# EAGLE design harp behavior (EAGLE 6.5.0)

## Sheet 1 of 4
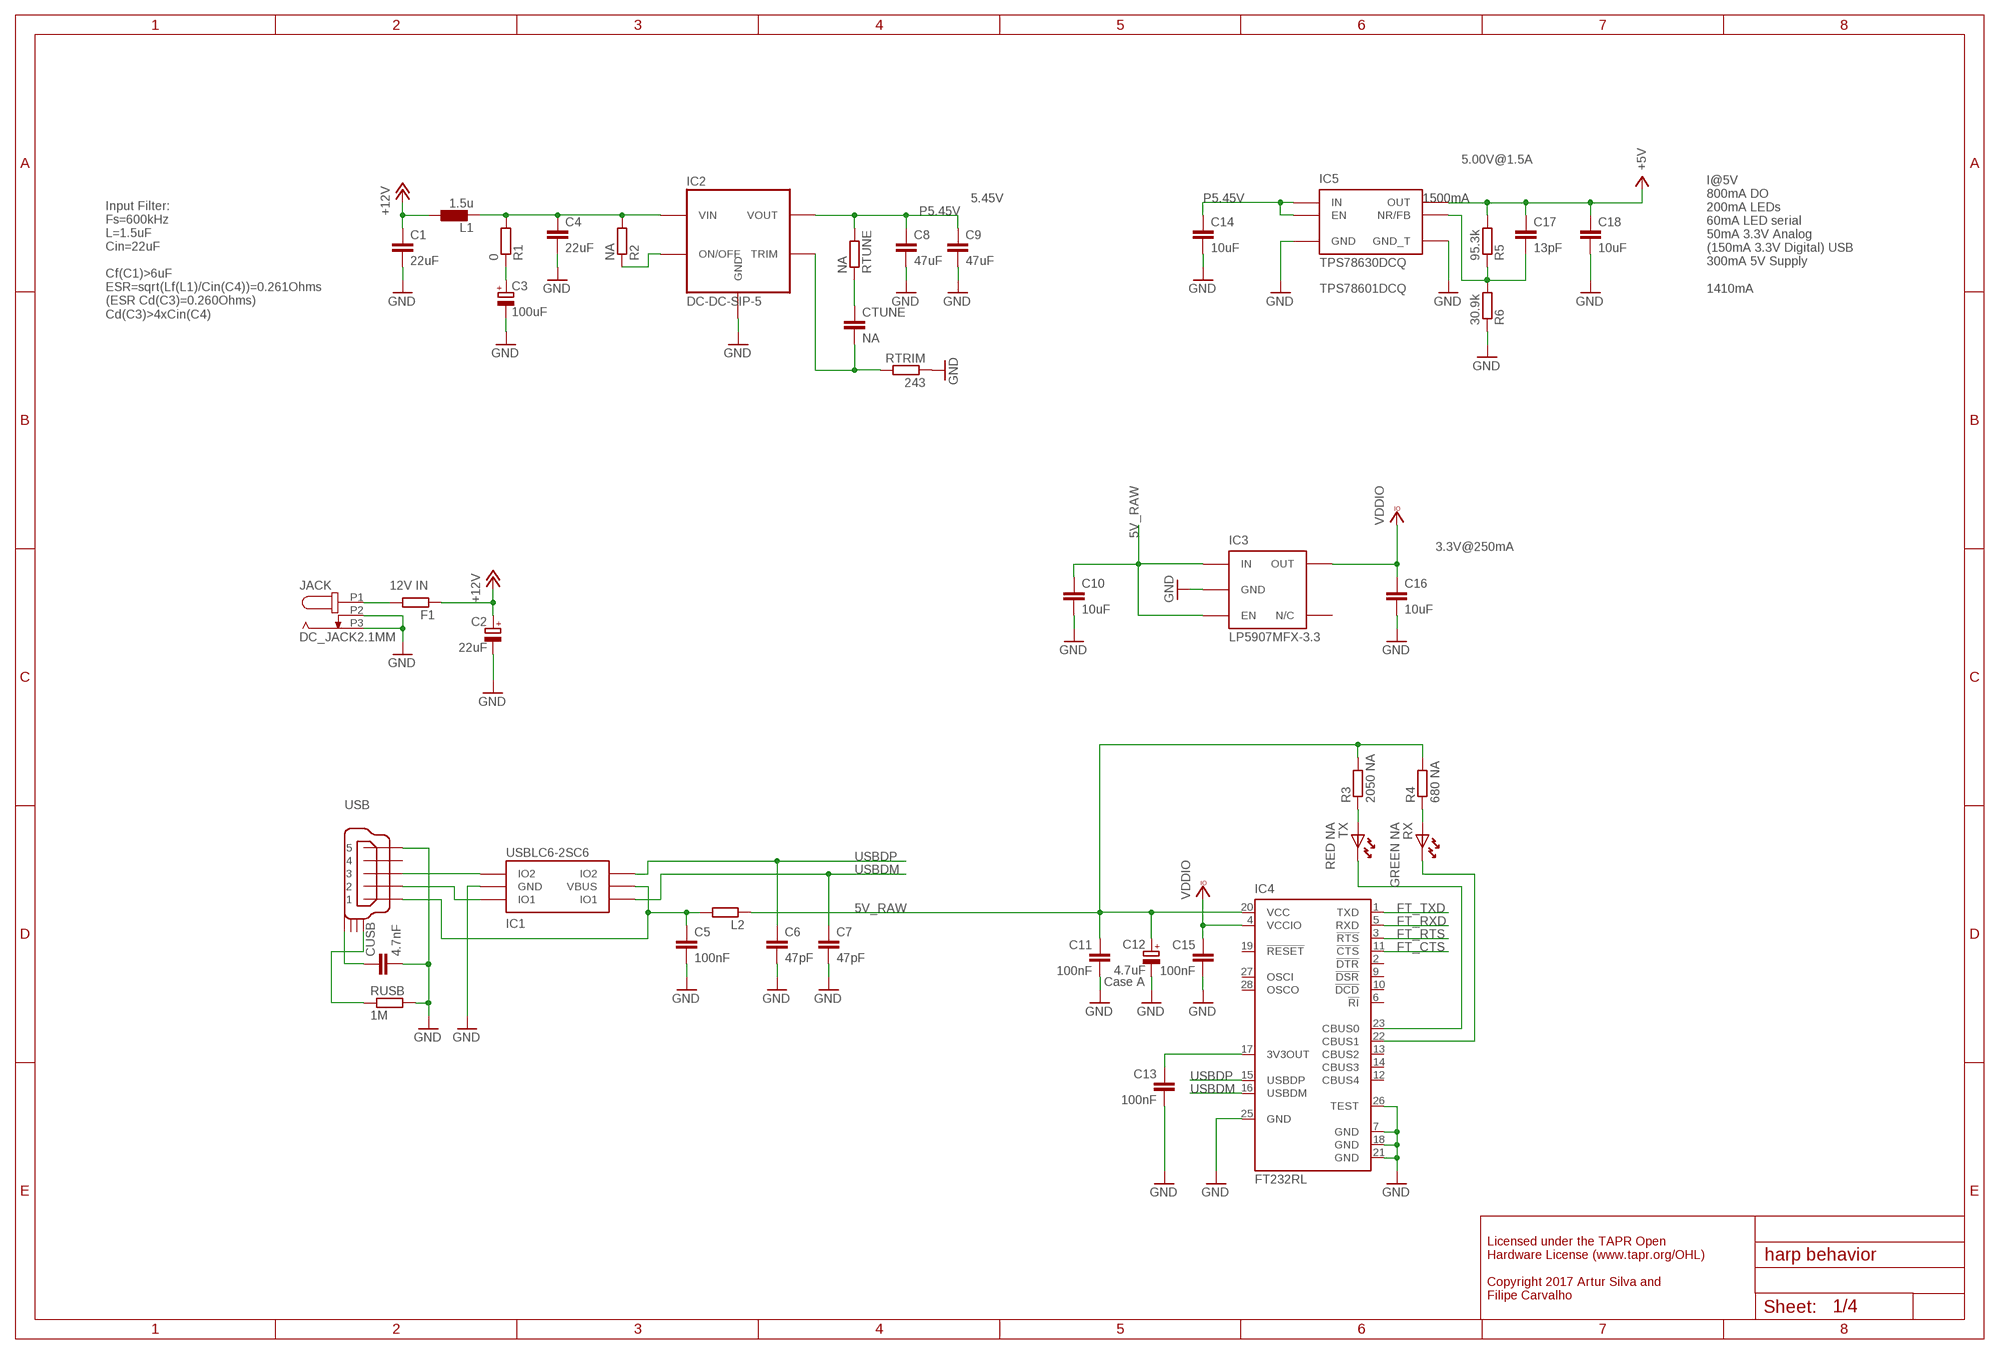
[diagram p0: schematic, sheet 1]

### Parts
C1  22uF  C-EUC1210  [C1210]
C2  22uF  CAP_100UFHAND  [CAP_100UF_HAND]
C3  100uF  CPOL-EUE  [PANASONIC_E]
C4  22uF  C-EUC1210  [C1210]
C5  100nF  C-EUC0402  [C0402]
C6  47pF  C-EUC0402  [C0402]
C7  47pF  C-EUC0402  [C0402]
C8  47uF  C-EUC1210  [C1210]
C9  47uF  C-EUC1210  [C1210]
C10  10uF  C-EUC0603  [C0603]
C11  100nF  C-EUC0402  [C0402]
C12  4.7uF  CPOL-EUA/3216-18W  [A/3216-18W]
C13  100nF  C-EUC0402  [C0402]
C14  10uF  C-EUC0603  [C0603]
C15  100nF  C-EUC0402  [C0402]
C16  10uF  C-EUC0603  [C0603]
C17  13pF  C-EUC0402  [C0402]
C18  10uF  C-EUC0603  [C0603]
CTUNE  NA  C-EUC0402  [C0402]
CUSB  4.7nF  C-EUC0402  [C0402]
F1  1A FB  R-EU_R0603  [R0603]
IC1  USBLC6-2SC6  USBLC6-2  [SOT23-6L]
IC2  DC-DC-SIP-5  [SIP-5]
IC3  LP5907MFX-3.3  TLV700XX  [TSOT23-5]
IC4  FT232RL  [SSOP28]
IC5  TPS78630DCQ  TPS795XX  [SOT223-6]
JACK  DC_JACK2.1MM  [DC_POWER_INPUT_2.1MM]
L1  1.5u  INDLPS4012  [IND_LPS4012]
L2  ???  R-EU_R0805  [R0805]
R1  0  R-EU_R0402  [R0402]
R2  NA  R-EU_R0402  [R0402]
R3  2050 NA  R-EU_R0402  [R0402]
R4  680 NA  R-EU_R0402  [R0402]
R5  95.3k  R-EU_R0402  [R0402]
R6  30.9k  R-EU_R0402  [R0402]
RTRIM  243  R-EU_R0402  [R0402]
RTUNE  NA  R-EU_R0402  [R0402]
RUSB  1M  R-EU_R0402  [R0402]
RX  GREEN NA  LEDHAND  [LED_HAND]
TX  RED NA  LEDHAND  [LED_HAND]
USB  USB_MINI_B  [240-0002-1]

### Nets
5V_RAW: C10.1 C11.1 C12.+ IC3.1(IN) IC3.3(EN) IC4.20(VCC) L2.1 R3.2 R4.2
+5V: C17.1 C18.1 IC5.P$4(OUT) R5.2 ; also sheet 2,3,4
+12V: C1.1 C2.+ F1.1 L1.1 ; also sheet 4
DCIN: C4.1 IC2.P2(VIN) L1.2 R1.2 R2.2
FT_CTS: IC4.11(!CTS) ; also sheet 2
FT_RTS: IC4.3(!RTS) ; also sheet 2
FT_RXD: IC4.5(RXD) ; also sheet 2
FT_TXD: IC4.1(TXD) ; also sheet 2
GND: C1.2 C2.- C3.- C4.2 C5.2 C6.2 C7.2 C8.2 C9.2 C10.2 C11.2 C12.- C13.2 C14.2 C15.2 C16.2 C18.2 CUSB.2 IC1.P$2(GND) IC2.P3(GND) IC3.2(GND) IC4.7(GND) IC4.18(GND) IC4.21(GND) IC4.25(GND) IC4.26(TEST) IC5.P$3(GND) IC5.P$6(GND_T) JACK.P2 JACK.P3 R6.1 RTRIM.1 RUSB.2 USB.P$5 ; also sheet 2,3,4
N$12: CTUNE.2 IC2.P5(TRIM) RTRIM.2
N$14: CTUNE.1 RTUNE.1
N$16: IC2.P1(ON/OFF) R2.1
N$18: F1.2 JACK.P1
N$20: C17.2 IC5.P$5(NR/FB) R5.1 R6.2
N$24: C3.+ R1.1
N$38: C13.1 IC4.17(3V3OUT)
N$39: C5.1 IC1.P$5(VBUS) L2.2 USB.P$1
N$40: IC1.P$1(IO1) USB.P$2
N$47: R4.1 RX.A
N$48: IC4.23(CBUS0) TX.K
N$49: IC4.22(CBUS1) RX.K
N$50: IC1.P$3(IO2) USB.P$3
N$59: CUSB.1 USB.SHIELD_4
N$61: RUSB.1 USB.SHIELD_1
N$62: R3.1 TX.A
P5.45V: C8.1 C9.1 C14.1 IC2.P4(VOUT) IC5.P$1(EN) IC5.P$2(IN) RTUNE.2
USBDM: C7.1 IC1.P$6(IO1) IC4.16(USBDM)
USBDP: C6.1 IC1.P$4(IO2) IC4.15(USBDP)
VCCIO: C15.1 C16.1 IC3.5(OUT) IC4.4(VCCIO) ; supply symbol labelled VDDIO ; also sheet 2,3,4
Unconnected: IC3.4(N/C) IC4.2(!DTR) IC4.6(!RI) IC4.9(!DSR) IC4.10(!DCD) IC4.12(CBUS4) IC4.13(CBUS2) IC4.14(CBUS3) IC4.19(!RESET) IC4.27(OSCI) IC4.28(OSCO) USB.P$4 USB.SHIELD_2 USB.SHIELD_3

### Notes on the sheet
- 5.00V@1.5A
- 5.45V | 1500mA
- TPS78601DCQ
- I@5V
  800mA DO
  200mA LEDs
  60mA LED serial
  50mA 3.3V Analog
  (150mA 3.3V Digital) USB
  300mA 5V Supply
  
  1410mA
- Input Filter:
  Fs=600kHz
  L=1.5uF
  Cin=22uF
  
  Cf(C1)>6uF
  ESR=sqrt(Lf(L1)/Cin(C4))=0.261Ohms
  (ESR Cd(C3)=0.260Ohms)
  Cd(C3)>4xCin(C4)
- 3.3V@250mA
- 12V IN
- Case A
- Licensed under the TAPR Open
  Hardware License (www.tapr.org/OHL)
  
  Copyright 2017 Artur Silva and 
  Filipe Carvalho

## Sheet 2 of 4
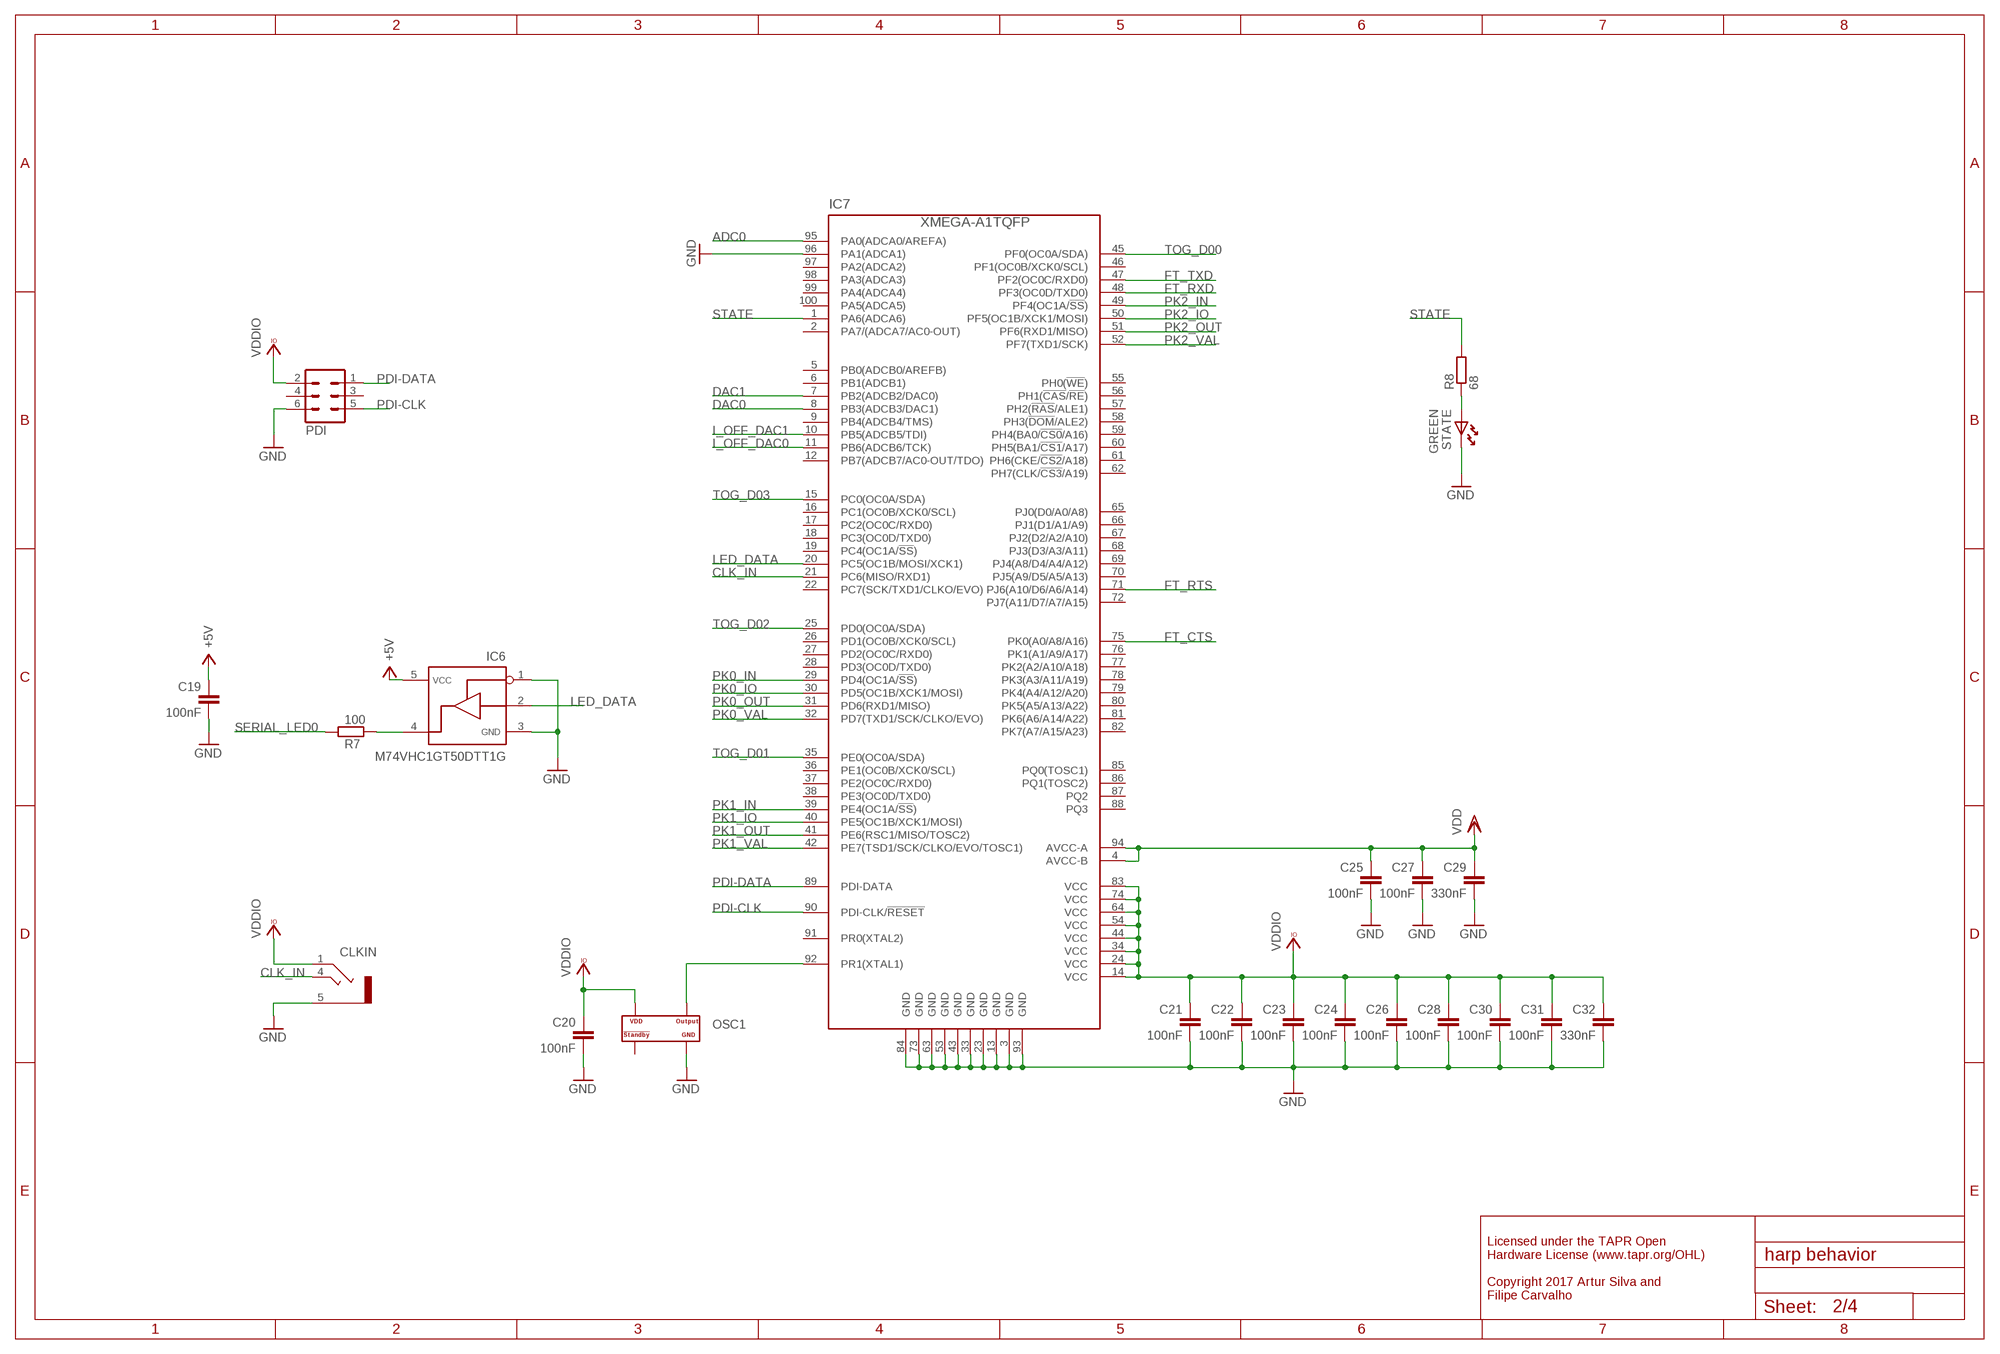
[diagram p1: schematic, sheet 2]

### Parts
C19  100nF  C-EUC0402  [C0402]
C20  100nF  C-EUC0402  [C0402]
C21  100nF  C-EUC0402  [C0402]
C22  100nF  C-EUC0402  [C0402]
C23  100nF  C-EUC0402  [C0402]
C24  100nF  C-EUC0402  [C0402]
C25  100nF  C-EUC0402  [C0402]
C26  100nF  C-EUC0402  [C0402]
C27  100nF  C-EUC0402  [C0402]
C28  100nF  C-EUC0402  [C0402]
C29  330nF  C-EUC0402  [C0402]
C30  100nF  C-EUC0402  [C0402]
C31  100nF  C-EUC0402  [C0402]
C32  330nF  C-EUC0402  [C0402]
CLKIN  STEREO_JACK  [35RASMT2BHNTRX]
IC6  M74VHC1GT50DTT1G  SN74LVC1G125  [SOT23-5]
IC7  XMEGA-A1TQFP  [TQFP100]
OSC1  OSCILLATOR  [OSCILLATOR_3.2X2.5]
PDI  MA03-2  [MA03-2]
R7  100  R-EU_R0402  [R0402]
R8  68  R-EU_R0402  [R0402]
STATE  GREEN  LEDHAND  [LED_HAND]

### Nets
+5V: C19.1 IC6.5 ; also sheet 1,3,4
ADC0: IC7.95(PA0(ADCA0/AREFA)) ; also sheet 3
CLK_IN: CLKIN.4 IC7.21(PC6(MISO/RXD1))
DAC0: IC7.8(PB3(ADCB3/DAC1)) ; also sheet 3
DAC1: IC7.7(PB2(ADCB2/DAC0)) ; also sheet 3
FT_CTS: IC7.75(PK0(A0/A8/A16)) ; also sheet 1
FT_RTS: IC7.71(PJ6(A10/D6/A6/A14)) ; also sheet 1
FT_RXD: IC7.48(PF3(OC0D/TXD0)) ; also sheet 1
FT_TXD: IC7.47(PF2(OC0C/RXD0)) ; also sheet 1
GND: C19.2 C20.2 C21.2 C22.2 C23.2 C24.2 C25.2 C26.2 C27.2 C28.2 C29.2 C30.2 C31.2 C32.2 CLKIN.5 IC6.1 IC6.3 IC7.3(GND) IC7.13(GND) IC7.23(GND) IC7.33(GND) IC7.43(GND) IC7.53(GND) IC7.63(GND) IC7.73(GND) IC7.84(GND) IC7.93(GND) IC7.96(PA1(ADCA1)) OSC1.P$2(GND) PDI.6 STATE.K ; also sheet 1,3,4
I_OFF_DAC0: IC7.11(PB6(ADCB6/TCK)) ; also sheet 3
I_OFF_DAC1: IC7.10(PB5(ADCB5/TDI)) ; also sheet 3
LED_DATA: IC6.2 IC7.20(PC5(OC1B/MOSI/XCK1))
N$13: IC6.4 R7.2
N$23: R8.1 STATE.A
OSC1: IC7.92(PR1(XTAL1)) OSC1.P$3(OUTPUT)
PDI-CLK: IC7.90(PDI-CLK/!RESET) PDI.5
PDI-DATA: IC7.89(PDI-DATA) PDI.1
PK0_IN: IC7.29(PD4(OC1A/!SS!)) ; also sheet 4
PK0_IO: IC7.30(PD5(OC1B/XCK1/MOSI)) ; also sheet 4
PK0_OUT: IC7.31(PD6(RXD1/MISO)) ; also sheet 4
PK0_VAL: IC7.32(PD7(TXD1/SCK/CLKO/EVO)) ; also sheet 4
PK1_IN: IC7.39(PE4(OC1A/!SS!)) ; also sheet 4
PK1_IO: IC7.40(PE5(OC1B/XCK1/MOSI)) ; also sheet 4
PK1_OUT: IC7.41(PE6(RSC1/MISO/TOSC2)) ; also sheet 4
PK1_VAL: IC7.42(PE7(TSD1/SCK/CLKO/EVO/TOSC1)) ; also sheet 4
PK2_IN: IC7.49(PF4(OC1A/!SS!)) ; also sheet 4
PK2_IO: IC7.50(PF5(OC1B/XCK1/MOSI)) ; also sheet 4
PK2_OUT: IC7.51(PF6(RXD1/MISO)) ; also sheet 4
PK2_VAL: IC7.52(PF7(TXD1/SCK)) ; also sheet 4
SERIAL_LED0: R7.1 ; also sheet 3
STATE: IC7.1(PA6(ADCA6)) R8.2
TOG_D00: IC7.45(PF0(OC0A/SDA)) ; also sheet 3
TOG_D01: IC7.35(PE0(OC0A/SDA)) ; also sheet 3
TOG_D02: IC7.25(PD0(OC0A/SDA)) ; also sheet 3
TOG_D03: IC7.15(PC0(OC0A/SDA)) ; also sheet 3
VCCIO: C20.1 C21.1 C22.1 C23.1 C24.1 C26.1 C28.1 C30.1 C31.1 C32.1 CLKIN.1 IC7.14(VCC) IC7.24(VCC) IC7.34(VCC) IC7.44(VCC) IC7.54(VCC) IC7.64(VCC) IC7.74(VCC) IC7.83(VCC) OSC1.P$4(VDD) PDI.2 ; supply symbol labelled VDDIO ; also sheet 1,3,4
VDD: C25.1 C27.1 C29.1 IC7.4(AVCC-B) IC7.94(AVCC-A) ; also sheet 3
Unconnected: IC7.2(PA7/(ADCA7/AC0-OUT)) IC7.5(PB0(ADCB0/AREFB)) IC7.6(PB1(ADCB1)) IC7.9(PB4(ADCB4/TMS)) IC7.12(PB7(ADCB7/AC0-OUT/TDO)) IC7.16(PC1(OC0B/XCK0/SCL)) IC7.17(PC2(OC0C/RXD0)) IC7.18(PC3(OC0D/TXD0)) IC7.19(PC4(OC1A/!SS!)) IC7.22(PC7(SCK/TXD1/CLKO/EVO)) IC7.26(PD1(OC0B/XCK0/SCL)) IC7.27(PD2(OC0C/RXD0)) IC7.28(PD3(OC0D/TXD0)) IC7.36(PE1(OC0B/XCK0/SCL)) IC7.37(PE2(OC0C/RXD0)) IC7.38(PE3(OC0D/TXD0)) IC7.46(PF1(OC0B/XCK0/SCL)) IC7.55(PH0(!WE!)) IC7.56(PH1(!CAS!/!RE!)) IC7.57(PH2(!RAS!/ALE1)) IC7.58(PH3(!DOM!/ALE2)) IC7.59(PH4(BA0/!CS0!/A16)) IC7.60(PH5(BA1/!CS1!/A17)) IC7.61(PH6(CKE/!CS2!/A18)) IC7.62(PH7(CLK/!CS3!/A19)) IC7.65(PJ0(D0/A0/A8)) IC7.66(PJ1(D1/A1/A9)) IC7.67(PJ2(D2/A2/A10)) IC7.68(PJ3(D3/A3/A11)) IC7.69(PJ4(A8/D4/A4/A12)) IC7.70(PJ5(A9/D5/A5/A13)) IC7.72(PJ7(A11/D7/A7/A15)) IC7.76(PK1(A1/A9/A17)) IC7.77(PK2(A2/A10/A18)) IC7.78(PK3(A3/A11/A19)) IC7.79(PK4(A4/A12/A20)) IC7.80(PK5(A5/A13/A22)) IC7.81(PK6(A6/A14/A22)) IC7.82(PK7(A7/A15/A23)) IC7.85(PQ0(TOSC1)) IC7.86(PQ1(TOSC2)) IC7.87(PQ2) IC7.88(PQ3) IC7.91(PR0(XTAL2)) IC7.97(PA2(ADCA2)) IC7.98(PA3(ADCA3)) IC7.99(PA4(ADCA4)) IC7.100(PA5(ADCA5)) OSC1.P$1(STANDBY#) PDI.3 PDI.4

### Notes on the sheet
- Licensed under the TAPR Open
  Hardware License (www.tapr.org/OHL)
  
  Copyright 2017 Artur Silva and 
  Filipe Carvalho

## Sheet 3 of 4
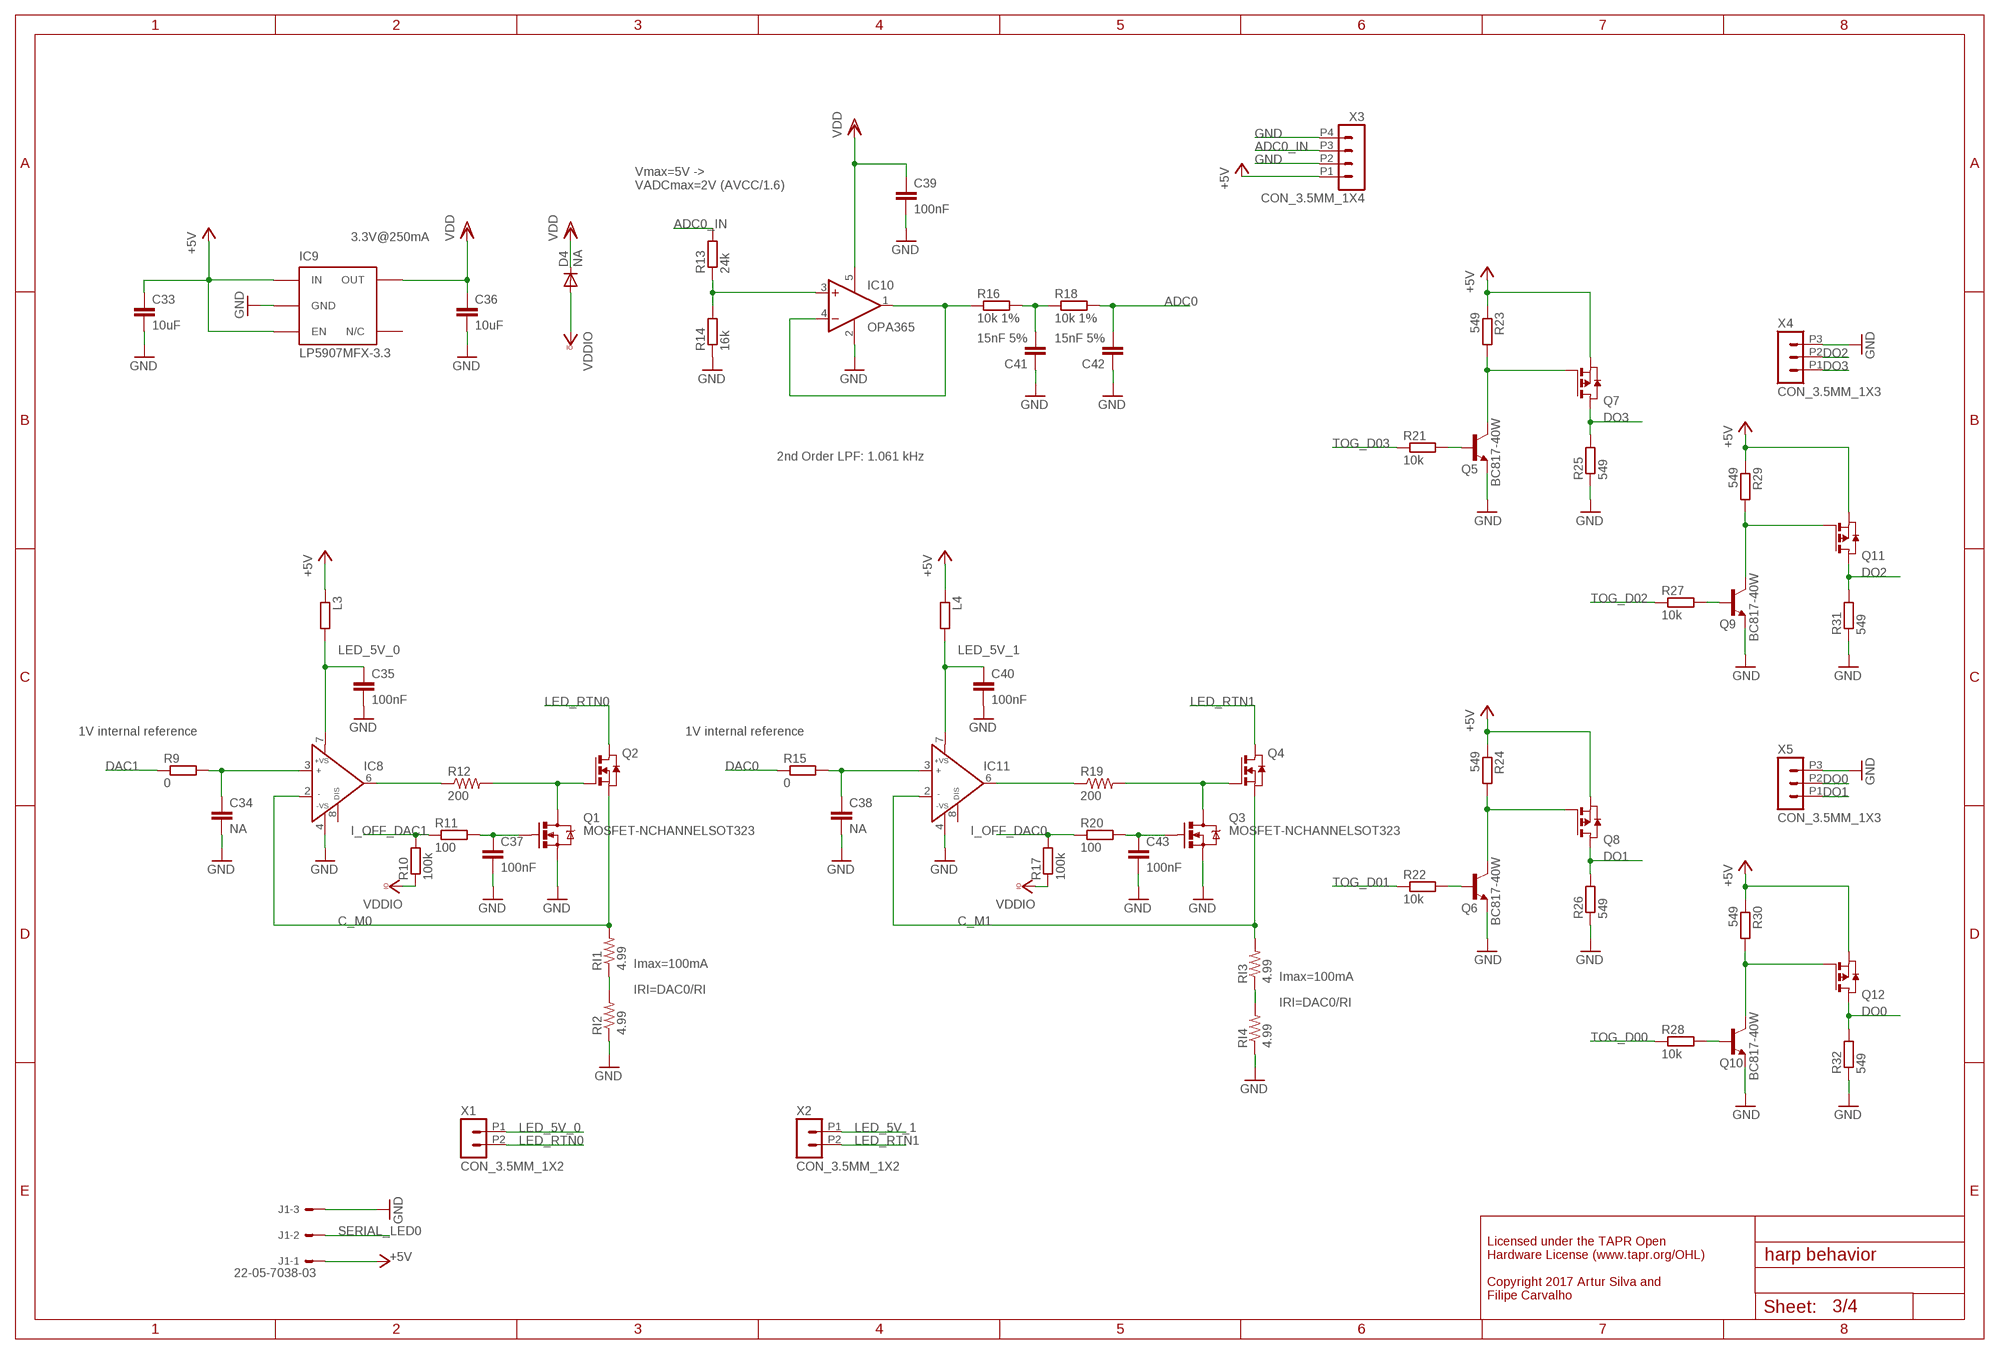
[diagram p2: schematic, sheet 3]

### Parts
C33  10uF  C-EUC0603  [C0603]
C34  NA  C-EUC0402  [C0402]
C35  100nF  C-EUC0402  [C0402]
C36  10uF  C-EUC0603  [C0603]
C37  100nF  C-EUC0402  [C0402]
C38  NA  C-EUC0402  [C0402]
C39  100nF  C-EUC0402  [C0402]
C40  100nF  C-EUC0402  [C0402]
C41  15nF 5%  C-EUC0402  [C0402]
C42  15nF 5%  C-EUC0402  [C0402]
C43  100nF  C-EUC0402  [C0402]
D4  NA  DIODE-SOD323-R  [SOD323-R]
IC8  AD8041R  [SO8]
IC9  LP5907MFX-3.3  TLV700XX  [TSOT23-5]
IC10  OPA365  [SOT23-5]
IC11  AD8041R  [SO8]
J1  22-05-7038-03  [7395-03]
L3  600@100M  R-EU_R0805  [R0805]
L4  600@100M  R-EU_R0805  [R0805]
Q1  MOSFET-NCHANNELSOT323  [SOT323]
Q2  NMOSSOT223  [SOT223]
Q3  MOSFET-NCHANNELSOT323  [SOT323]
Q4  NMOSSOT223  [SOT223]
Q5  BC817-40W  BC817  [SOT323-BEC]
Q6  BC817-40W  BC817  [SOT323-BEC]
Q7  PMOSSOT223  [SOT223]
Q8  PMOSSOT223  [SOT223]
Q9  BC817-40W  BC817  [SOT323-BEC]
Q10  BC817-40W  BC817  [SOT323-BEC]
Q11  PMOSSOT223  [SOT223]
Q12  PMOSSOT223  [SOT223]
R9  0  R-EU_R0402  [R0402]
R10  100k  R-EU_R0402  [R0402]
R11  100  R-EU_R0402  [R0402]
R12  200  R-US_R1210  [R1210]
R13  24k  R-EU_R0402  [R0402]
R14  16k  R-EU_R0402  [R0402]
R15  0  R-EU_R0402  [R0402]
R16  10k 1%  R-EU_R0402  [R0402]
R17  100k  R-EU_R0402  [R0402]
R18  10k 1%  R-EU_R0402  [R0402]
R19  200  R-US_R1210  [R1210]
R20  100  R-EU_R0402  [R0402]
R21  10k  R-EU_R0402  [R0402]
R22  10k  R-EU_R0402  [R0402]
R23  549  R-EU_R0805  [R0805]
R24  549  R-EU_R0805  [R0805]
R25  549  R-EU_R0805  [R0805]
R26  549  R-EU_R0805  [R0805]
R27  10k  R-EU_R0402  [R0402]
R28  10k  R-EU_R0402  [R0402]
R29  549  R-EU_R0805  [R0805]
R30  549  R-EU_R0805  [R0805]
R31  549  R-EU_R0805  [R0805]
R32  549  R-EU_R0805  [R0805]
RI1  4.99  R-US_R2512  [R2512]
RI2  4.99  R-US_R2512  [R2512]
RI3  4.99  R-US_R2512  [R2512]
RI4  4.99  R-US_R2512  [R2512]
X1  CON_3.5MM_1X2  [CON_3.5MM_1X2]
X2  CON_3.5MM_1X2  [CON_3.5MM_1X2]
X3  CON_3.5MM_1X4  [CON_3.5MM_1X4]
X4  CON_3.5MM_1X3  [CON_3.5MM_1X3]
X5  CON_3.5MM_1X3  [CON_3.5MM_1X3]

### Nets
+5V: C33.1 IC9.1(IN) IC9.3(EN) J1.1 L3.1 L4.1 Q7.3(S) Q8.3(S) Q11.3(S) Q12.3(S) R23.1 R24.1 R29.1 R30.1 X3.P1 ; also sheet 1,2,4
ADC0: C42.2 R18.2 ; also sheet 2
ADC0_IN: R13.2 X3.P3
C_M0: IC8.2(IN-) Q2.3(S) RI1.2
C_M1: IC11.2(IN-) Q4.3(S) RI3.2
CTRL_BL: IC11.6(OUT) R19.1
CTRL_BL1: IC8.6(OUT) R12.1
DAC0: R15.1 ; also sheet 2
DAC1: R9.1 ; also sheet 2
DO0: Q12.2(D) Q12.4(D) R32.2 X5.P2
DO1: Q8.2(D) Q8.4(D) R26.2 X5.P1
DO2: Q11.2(D) Q11.4(D) R31.2 X4.P2
DO3: Q7.2(D) Q7.4(D) R25.2 X4.P1
GND: C33.2 C34.2 C35.2 C36.2 C37.2 C38.2 C39.2 C40.2 C41.1 C42.1 C43.2 IC8.4(-VS) IC9.2(GND) IC10.2(V-) IC11.4(-VS) J1.3 Q1.2(S) Q3.2(S) Q5.E Q6.E Q9.E Q10.E R14.1 R25.1 R26.1 R31.1 R32.1 RI2.1 RI4.1 X3.P2 X3.P4 X4.P3 X5.P3 ; also sheet 1,2,4
I_OFF_DAC0: R17.2 R20.1 ; also sheet 2
I_OFF_DAC1: R10.2 R11.1 ; also sheet 2
LED_5V_0: C35.1 IC8.7(+VS) L3.2 X1.P1
LED_5V_1: C40.1 IC11.7(+VS) L4.2 X2.P1
LED_RTN0: Q2.2(D) Q2.4(D) X1.P2
LED_RTN1: Q4.2(D) Q4.4(D) X2.P2
N$1: Q3.3(D) Q4.1(G) R19.2
N$3: Q6.C Q8.1(G) R24.2
N$5: Q6.B R22.2
N$7: Q9.C Q11.1(G) R29.2
N$8: Q9.B R27.2
N$9: Q10.C Q12.1(G) R30.2
N$10: Q10.B R28.2
N$11: Q1.3(D) Q2.1(G) R12.2
N$15: C34.1 IC8.3(IN+) R9.2
N$21: C38.1 IC11.3(IN+) R15.2
N$22: RI1.1 RI2.2
N$25: Q5.C Q7.1(G) R23.2
N$27: Q5.B R21.2
N$28: C37.1 Q1.1(G) R11.2
N$30: C43.1 Q3.1(G) R20.2
N$45: RI3.1 RI4.2
N$56: C41.2 R16.2 R18.1
N$58: IC10.1(OUT) IC10.4(-IN) R16.1
N$64: IC10.3(+IN) R13.1 R14.2
SERIAL_LED0: J1.2 ; also sheet 2
TOG_D00: R28.1 ; also sheet 2
TOG_D01: R22.1 ; also sheet 2
TOG_D02: R27.1 ; also sheet 2
TOG_D03: R21.1 ; also sheet 2
VCCIO: D4.A R10.1 R17.1 ; supply symbol labelled VDDIO ; also sheet 1,2,4
VDD: C36.1 C39.1 D4.C IC9.5(OUT) IC10.5(V+) ; also sheet 2
Unconnected: IC8.8(DISABLE) IC9.4(N/C) IC11.8(DISABLE)

### Notes on the sheet
- Vmax=5V -> 
  VADCmax=2V (AVCC/1.6)
- 3.3V@250mA
- 2nd Order LPF: 1.061 kHz
- 1V internal reference | 1V internal reference
- Imax=100mA
- Imax=100mA
- IRI=DAC0/RI
- IRI=DAC0/RI
- Licensed under the TAPR Open
  Hardware License (www.tapr.org/OHL)
  
  Copyright 2017 Artur Silva and 
  Filipe Carvalho

## Sheet 4 of 4
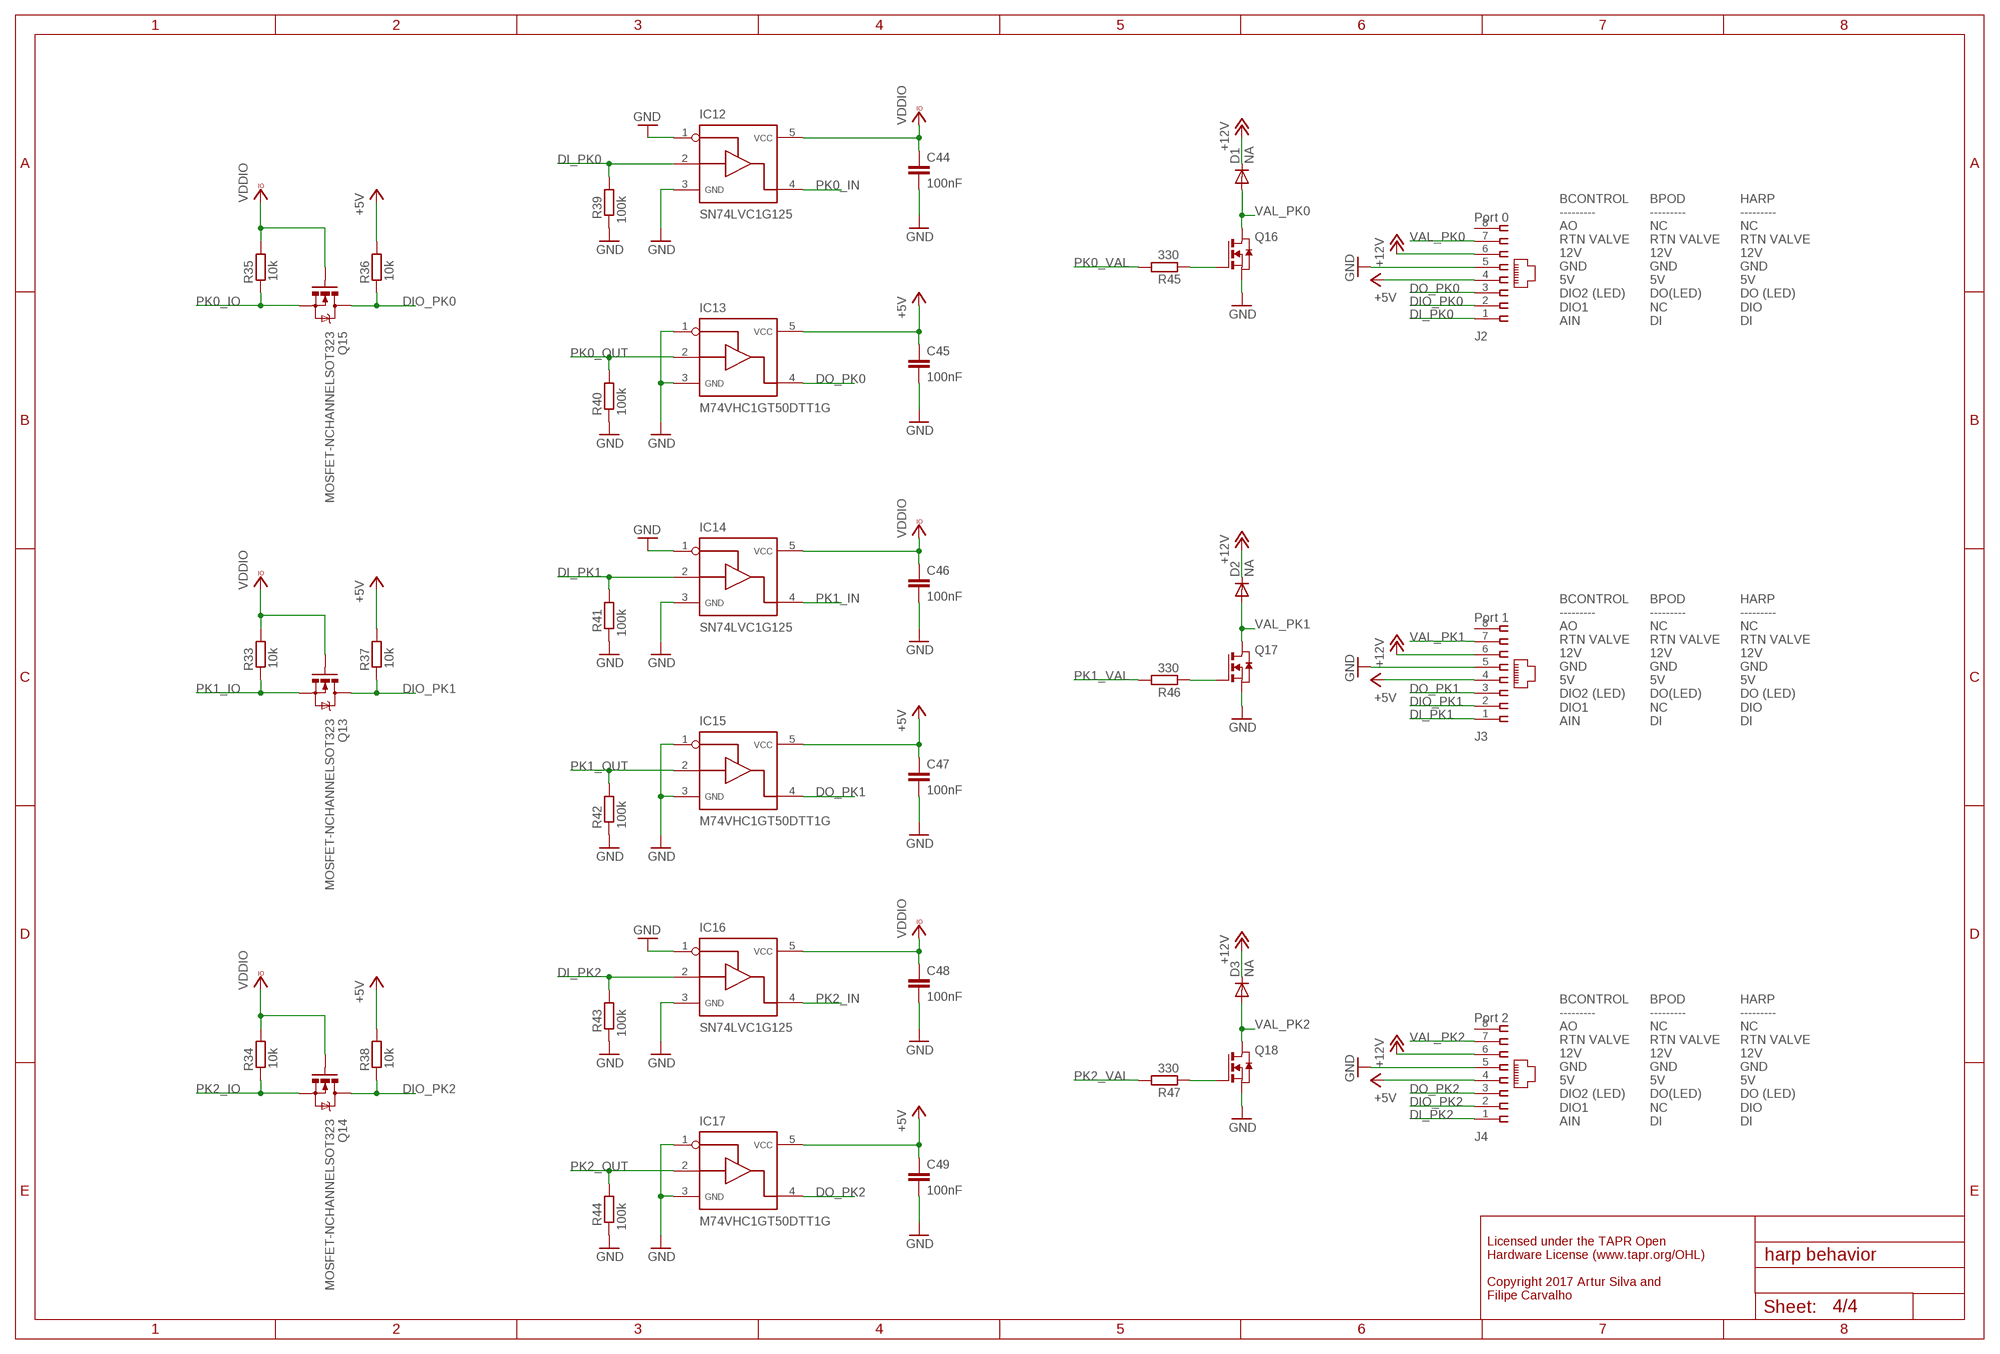
[diagram p3: schematic, sheet 4]

### Parts
C44  100nF  C-EUC0402  [C0402]
C45  100nF  C-EUC0402  [C0402]
C46  100nF  C-EUC0402  [C0402]
C47  100nF  C-EUC0402  [C0402]
C48  100nF  C-EUC0402  [C0402]
C49  100nF  C-EUC0402  [C0402]
D1  NA  DIODE-SOD323-R  [SOD323-R]
D2  NA  DIODE-SOD323-R  [SOD323-R]
D3  NA  DIODE-SOD323-R  [SOD323-R]
IC12  SN74LVC1G125  [SOT23-5]
IC13  M74VHC1GT50DTT1G  SN74LVC1G125  [SOT23-5]
IC14  SN74LVC1G125  [SOT23-5]
IC15  M74VHC1GT50DTT1G  SN74LVC1G125  [SOT23-5]
IC16  SN74LVC1G125  [SOT23-5]
IC17  M74VHC1GT50DTT1G  SN74LVC1G125  [SOT23-5]
J2  Port 0  520426-4  [520426-4]
J3  Port 1  520426-4  [520426-4]
J4  Port 2  520426-4  [520426-4]
Q13  MOSFET-NCHANNELSOT323  [SOT323]
Q14  MOSFET-NCHANNELSOT323  [SOT323]
Q15  MOSFET-NCHANNELSOT323  [SOT323]
Q16  NMOSSOT223  [SOT223]
Q17  NMOSSOT223  [SOT223]
Q18  NMOSSOT223  [SOT223]
R33  10k  R-EU_R0402  [R0402]
R34  10k  R-EU_R0402  [R0402]
R35  10k  R-EU_R0402  [R0402]
R36  10k  R-EU_R0402  [R0402]
R37  10k  R-EU_R0402  [R0402]
R38  10k  R-EU_R0402  [R0402]
R39  100k  R-EU_R0402  [R0402]
R40  100k  R-EU_R0402  [R0402]
R41  100k  R-EU_R0402  [R0402]
R42  100k  R-EU_R0402  [R0402]
R43  100k  R-EU_R0402  [R0402]
R44  100k  R-EU_R0402  [R0402]
R45  330  R-EU_R0402  [R0402]
R46  330  R-EU_R0402  [R0402]
R47  330  R-EU_R0402  [R0402]

### Nets
+5V: C45.1 C47.1 C49.1 IC13.5 IC15.5 IC17.5 J2.4 J3.4 J4.4 R36.1 R37.1 R38.1 ; also sheet 1,2,3
+12V: D1.C D2.C D3.C J2.6 J3.6 J4.6 ; also sheet 1
DI_PK0: IC12.2 J2.1 R39.1
DI_PK1: IC14.2 J3.1 R41.1
DI_PK2: IC16.2 J4.1 R43.1
DIO_PK0: J2.2 Q15.3(D) R36.2
DIO_PK1: J3.2 Q13.3(D) R37.2
DIO_PK2: J4.2 Q14.3(D) R38.2
DO_PK0: IC13.4 J2.3
DO_PK1: IC15.4 J3.3
DO_PK2: IC17.4 J4.3
GND: C44.2 C45.2 C46.2 C47.2 C48.2 C49.2 IC12.1 IC12.3 IC13.1 IC13.3 IC14.1 IC14.3 IC15.1 IC15.3 IC16.1 IC16.3 IC17.1 IC17.3 J2.5 J3.5 J4.5 Q16.3(S) Q17.3(S) Q18.3(S) R39.2 R40.1 R41.2 R42.1 R43.2 R44.2 ; also sheet 1,2,3
N$2: Q16.1(G) R45.2
N$4: Q17.1(G) R46.2
N$6: Q18.1(G) R47.2
PK0_IN: IC12.4 ; also sheet 2
PK0_IO: Q15.2(S) R35.2 ; also sheet 2
PK0_OUT: IC13.2 R40.2 ; also sheet 2
PK0_VAL: R45.1 ; also sheet 2
PK1_IN: IC14.4 ; also sheet 2
PK1_IO: Q13.2(S) R33.2 ; also sheet 2
PK1_OUT: IC15.2 R42.2 ; also sheet 2
PK1_VAL: R46.1 ; also sheet 2
PK2_IN: IC16.4 ; also sheet 2
PK2_IO: Q14.2(S) R34.2 ; also sheet 2
PK2_OUT: IC17.2 R44.1 ; also sheet 2
PK2_VAL: R47.1 ; also sheet 2
VAL_PK0: D1.A J2.7 Q16.2(D) Q16.4(D)
VAL_PK1: D2.A J3.7 Q17.2(D) Q17.4(D)
VAL_PK2: D3.A J4.7 Q18.2(D) Q18.4(D)
VCCIO: C44.1 C46.1 C48.1 IC12.5 IC14.5 IC16.5 Q13.1(G) Q14.1(G) Q15.1(G) R33.1 R34.1 R35.1 ; supply symbol labelled VDDIO ; also sheet 1,2,3
Unconnected: J2.8 J3.8 J4.8

### Notes on the sheet
- BCONTROL
  ---------
  AO
  RTN VALVE
  12V
  GND
  5V
  DIO2 (LED)
  DIO1
  AIN
- BPOD 
  ---------
  NC
  RTN VALVE
  12V
  GND
  5V
  DO(LED)
  NC
  DI
- HARP
  ---------
  NC
  RTN VALVE
  12V
  GND
  5V
  DO (LED)
  DIO
  DI
- BCONTROL
  ---------
  AO
  RTN VALVE
  12V
  GND
  5V
  DIO2 (LED)
  DIO1
  AIN
- BPOD 
  ---------
  NC
  RTN VALVE
  12V
  GND
  5V
  DO(LED)
  NC
  DI
- HARP
  ---------
  NC
  RTN VALVE
  12V
  GND
  5V
  DO (LED)
  DIO
  DI
- BCONTROL
  ---------
  AO
  RTN VALVE
  12V
  GND
  5V
  DIO2 (LED)
  DIO1
  AIN
- BPOD 
  ---------
  NC
  RTN VALVE
  12V
  GND
  5V
  DO(LED)
  NC
  DI
- HARP
  ---------
  NC
  RTN VALVE
  12V
  GND
  5V
  DO (LED)
  DIO
  DI
- Licensed under the TAPR Open
  Hardware License (www.tapr.org/OHL)
  
  Copyright 2017 Artur Silva and 
  Filipe Carvalho

## Library data of the parts
C1 C4-C11 C13-C49 CTUNE CUSB = rcl:C-EU: CAPACITOR, European symbol
C2 = CNP-miscellaneous:CAP_100UF
C3 C12 = rcl:CPOL-EU: POLARIZED CAPACITOR, European symbol
CLKIN = CNP-connectors:STEREO_JACK
D1-D4 = diode:DIODE-: DIODE
F1 L2-L4 R1-R11 R13-R18 R20-R47 RTRIM RTUNE RUSB = rcl:R-EU_: RESISTOR, European symbol
IC1 = CNP 2:USBLC6-2
IC2 = CNP-connectors:DC-DC-SIP-5
IC3 IC9 = CNP:TLV700XX
IC4 = ftdichip:FT232R: Source: http://www.ftdichip.com/Documents/DataSheets/DS_FT232R_v104.pdf; MPN: FT232RL; OC_FARNELL: 1146032; OC_NEWARK: 91K9918
IC5 = CNP:TPS795XX
IC6 IC12-IC17 = My_library 0v2:SN74LVC1G125
IC7 = avr-7:XMEGA-A1: Atmel XMega A1 Series processor
IC8 IC11 = analog-devices:AD8041: 160 MHz Rail-to-Rail Amplifier with Disable Source: http://www.analog.com/static/imported-files/data_sheets/AD8041.pdf; MF: ALTERA CORPORATION; MPN: AD8041ARZ; OC_FARNELL: 1464831; OC_NEWARK: 88H0130
IC10 = CNP-ics 2:OPA365
J1 = con-molex:22-?-03: CONNECTOR wire to board 2.54 mm (.1 inch) pitch header; OC_FARNELL: unknown; OC_NEWARK: unknown
J2-J4 = con-amp:520426-4: AMP connector
JACK = CNP-miscellaneous:DC_JACK
L1 = CNP-miscellaneous:IND
OSC1 = CNP-miscellaneous:OSCILLATOR
PDI = con-lstb:MA03-2: PIN HEADER; OC_FARNELL: unknown; OC_NEWARK: unknown
Q1 Q3 Q13-Q15 = fets:MOSFET-NCHANNEL: Generic NMOS footprint
Q2 Q4 Q16-Q18 = zetex:NMOSSOT223: MOS FET; OC_FARNELL: unknown; OC_NEWARK: unknown
Q5 Q6 Q9 Q10 = transistor-npn:BC817*: NPN Transistor
Q7 Q8 Q11 Q12 = zetex:PMOSSOT223: MOS FET; OC_FARNELL: unknown; OC_NEWARK: unknown
R12 R19 RI1-RI4 = rcl:R-US_: RESISTOR, American symbol
RX STATE TX = CNP-miscellaneous:LED
USB = CNP-connectors:USB_MINI_B
X1 X2 = CNP-connectors:CON_3.5MM_1X2
X3 = CNP-connectors:CON_3.5MM_1X4
X4 X5 = CNP-connectors:CON_3.5MM_1X3

## Board
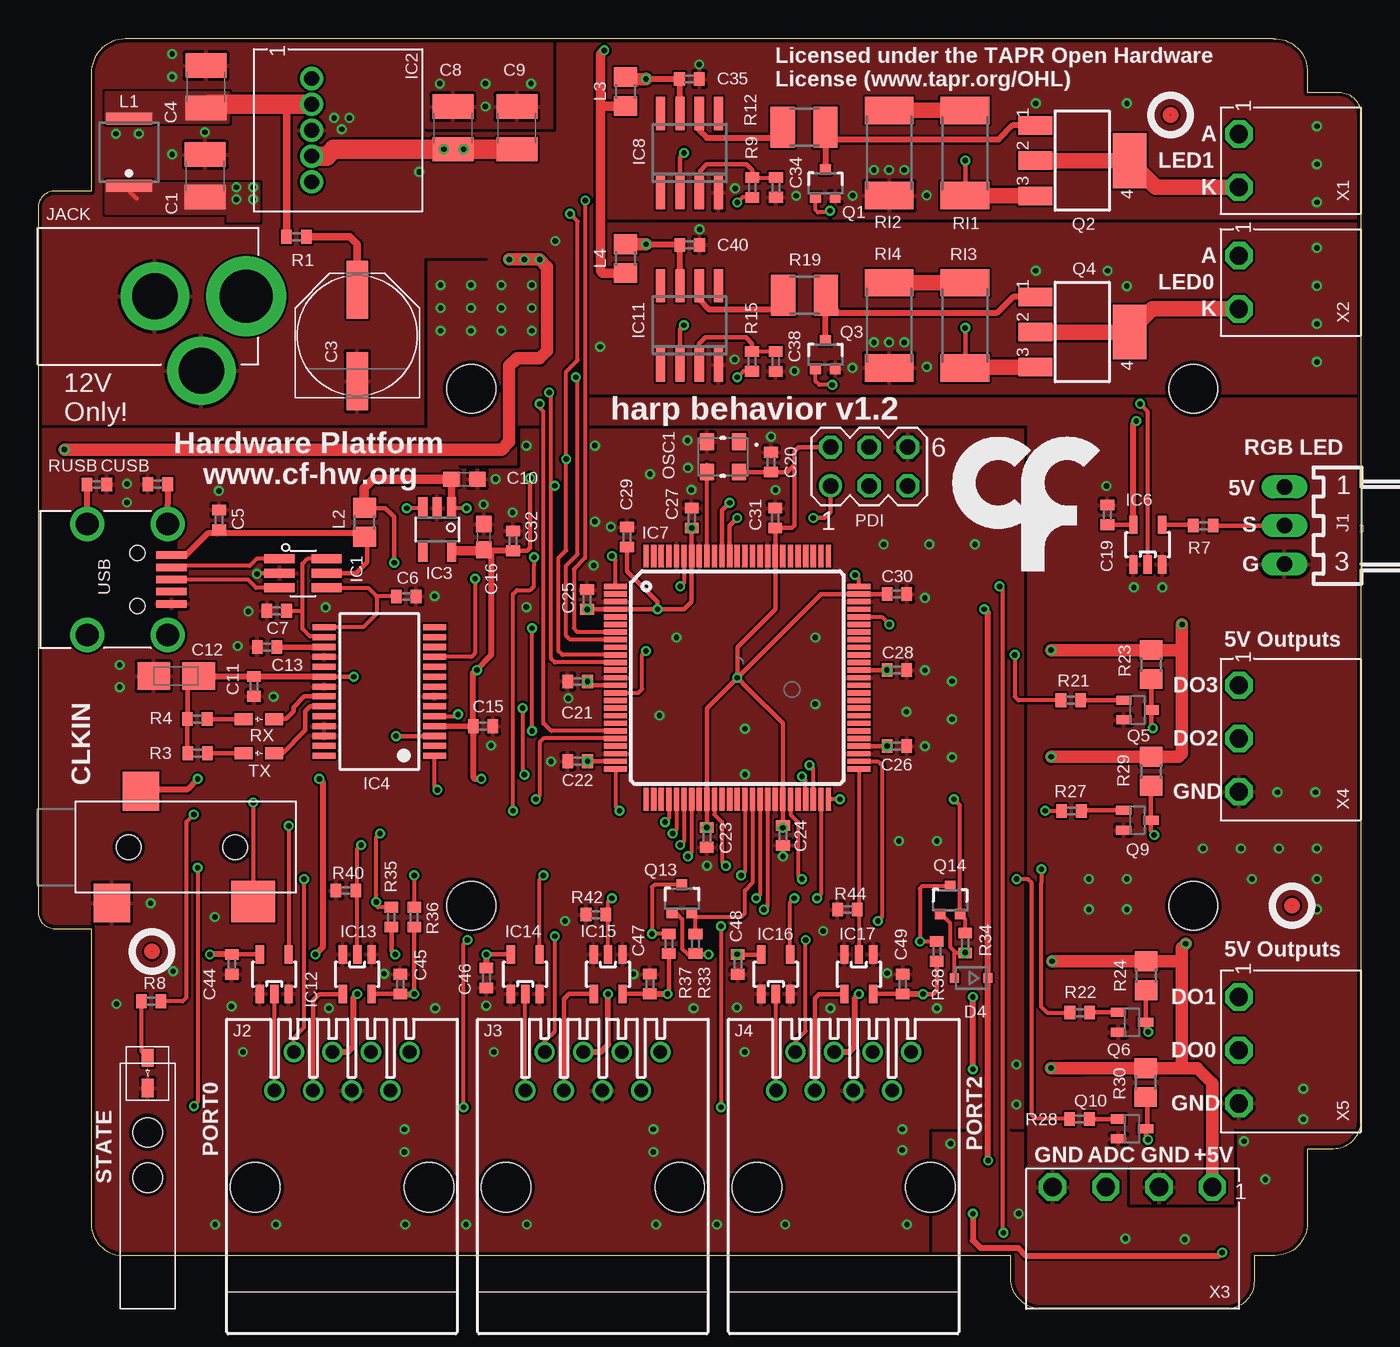
[diagram p4: board, top side]
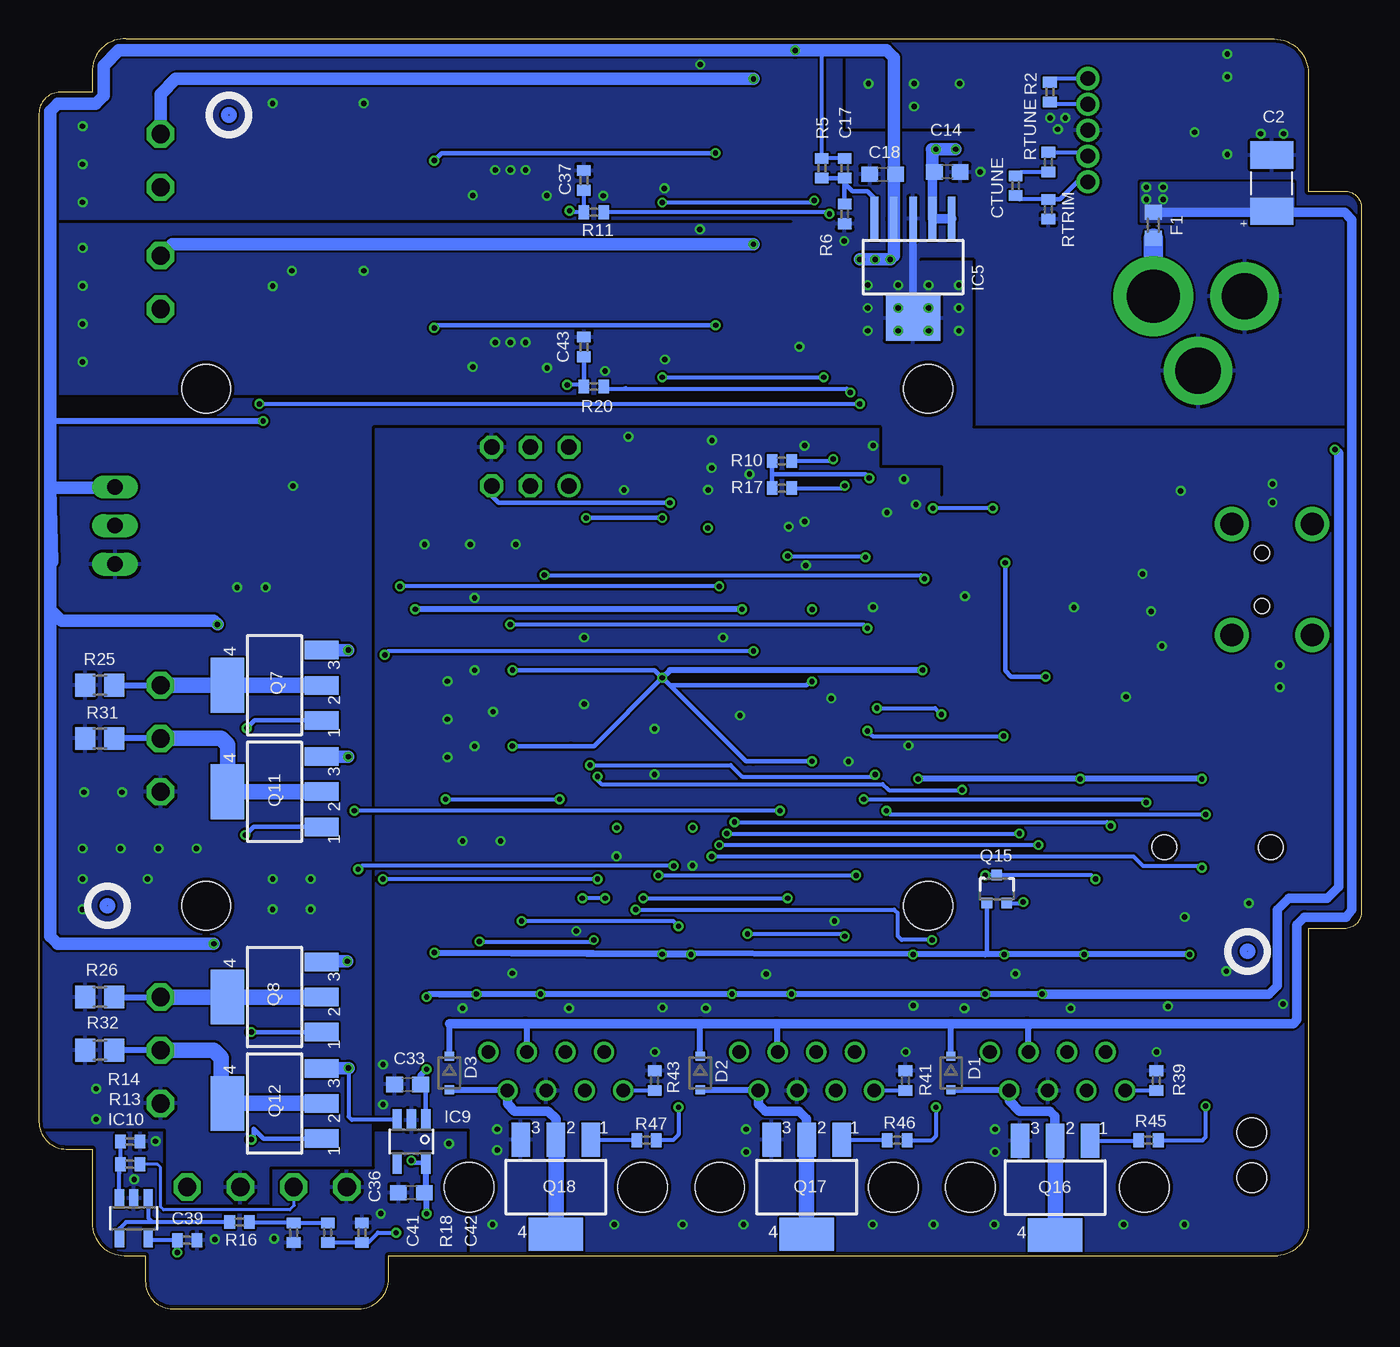
[diagram p5: board, bottom side, seen from below]

Size 87 x 83.5 mm. Coordinates in mm from the lower left corner, seen from the top.
Outline: 3.5,81.26 3.5,73.5 1.12,73.5 arc90 0,72.38 0,26.12 arc90 1.12,25 3.5,25 3.5,5.74 arc90 5.5,3.5 64,3.5 64,1.99 arc90 65.99,0 78.2,0 arc90 80,1.8 80,3.5 81.39,3.5 arc90 83.5,5.61 83.5,10.5 85.2,10.5 arc90 87,12.3 87,78.59 arc90 85.59,80 83.5,80 83.5,81.5 arc90 81.26,83.5 5.74,83.5 arc90 3.5,81.26
Copper layers (1*16): Top 0.018mm / dielectric 1.55mm / Bottom 0.018mm
Design rules "eC_2Layer_PClass6_BaseCopperO18_eCDefault *": minimum track width 0.15mm, minimum drill 0.35mm, track to track 0.15mm, track to pad 0.15mm, pad to pad 0.15mm, via to via 0.15mm, smd to smd 0mil, copper to edge 0.25mm, drill to drill 0.35mm, minimum pad ring 0.125mm, minimum via ring 0.125mm, stop-mask expansion 0mil, vias tented up to drill 0.45mm, thermal gap 0.2mm
Holes 3.2 mm at 28.5,60.5 28.5,26.5 76,60.5 76,26.5
tRestrict: 23 lines
bRestrict: 25 lines

### Footprints (pad centres in the part's own frame; a part is rotated, then mirrored left to right if it is on the bottom)
C1210 = smd 1.6 x 2.7: 1 -1.4,0; 2 1.4,0
CAP_100UF_HAND = smd 1.8 x 2.8: + -1.85,0; - 1.85,0
PANASONIC_E = smd 3.8 x 1.4: + 3,0; - -3,0
C0402 = smd 0.7 x 0.9: 1 -0.65,0; 2 0.65,0
C0603 = smd 1.1 x 1: 1 -0.85,0; 2 0.85,0
A/3216-18W = smd 2.15 x 1.8: + 1.475,0; - -1.475,0
35RASMT2BHNTRX = smd 2.4 x 2.55: 1 0.8,3.675; 5 -1.1,-3.675 | smd 2.9 x 2.75: 4 8.2,-3.575 | hole 1.6: 0,0; 7,0
SOD323-R = smd 0.6 x 0.6: A 1.1,0; C -1.1,0
R0603 = smd 1 x 1.1: 1 -0.85,0; 2 0.85,0
SOT23-6L = smd 0.6 x 2: P$1 -0.95,-1.55; P$2 0,-1.55; P$3 0.95,-1.55; P$4 0.95,1.55; P$5 0,1.55; P$6 -0.95,1.55
SIP-5 = drill 0.97 pad 1.52: P1 -3.4,0; P2 -1.7,0; P3 0,0; P4 1.7,0; P5 3.4,0
TSOT23-5 = smd 0.6 x 1.408: 1 -0.95,-1.404; 2 0,-1.404; 3 0.95,-1.404; 4 0.95,1.404; 5 -0.95,1.404
SSOP28 = smd 0.4 x 1.5: 1 -4.225,-3.625; 2 -3.575,-3.625; 3 -2.925,-3.625; 4 -2.275,-3.625; 5 -1.625,-3.625; 6 -0.975,-3.625; 7 -0.325,-3.625; 8 0.325,-3.625; 9 0.975,-3.625; 10 1.625,-3.625; 11 2.275,-3.625; 12 2.925,-3.625; 13 3.575,-3.625; 14 4.225,-3.625; 15 4.225,3.625; 16 3.575,3.625; 17 2.925,3.625; 18 2.275,3.625; 19 1.625,3.625; 20 0.975,3.625; 21 0.325,3.625; 22 -0.325,3.625; 23 -0.975,3.625; 24 -1.625,3.625; 25 -2.275,3.625; 26 -2.925,3.625; 27 -3.575,3.625; 28 -4.225,3.625
SOT223-6 = smd 0.508 x 2.87: P$1 -2.54,-3.175; P$2 -1.27,-3.175; P$3 0,-3.175; P$4 1.27,-3.175; P$5 2.54,-3.175 | smd 3.6 x 2.962: P$6 0,3.353
SOT23-5 = smd 0.55 x 1.2: 1 -0.95,-1.3; 2 0,-1.3; 3 0.95,-1.3; 4 0.95,1.3; 5 -0.95,1.3
TQFP100 = smd 1.5 x 0.35: 1 -8,6; 2 -8,5.5; 3 -8,5; 4 -8,4.5; 5 -8,4; 6 -8,3.5; 7 -8,3; 8 -8,2.5; 9 -8,2; 10 -8,1.5; 11 -8,1; 12 -8,0.5; 13 -8,0; 14 -8,-0.5; 15 -8,-1; 16 -8,-1.5; 17 -8,-2; 18 -8,-2.5; 19 -8,-3; 20 -8,-3.5; 21 -8,-4; 22 -8,-4.5; 23 -8,-5; 24 -8,-5.5; 25 -8,-6; 51 8,-6; 52 8,-5.5; 53 8,-5; 54 8,-4.5; 55 8,-4; 56 8,-3.5; 57 8,-3; 58 8,-2.5; 59 8,-2; 60 8,-1.5; 61 8,-1; 62 8,-0.5; 63 8,0; 64 8,0.5; 65 8,1; 66 8,1.5; 67 8,2; 68 8,2.5; 69 8,3; 70 8,3.5; 71 8,4; 72 8,4.5; 73 8,5; 74 8,5.5; 75 8,6 | smd 0.35 x 1.5: 26 -6,-8; 27 -5.5,-8; 28 -5,-8; 29 -4.5,-8; 30 -4,-8; 31 -3.5,-8; 32 -3,-8; 33 -2.5,-8; 34 -2,-8; 35 -1.5,-8; 36 -1,-8; 37 -0.5,-8; 38 0,-8; 39 0.5,-8; 40 1,-8; 41 1.5,-8; 42 2,-8; 43 2.5,-8; 44 3,-8; 45 3.5,-8; 46 4,-8; 47 4.5,-8; 48 5,-8; 49 5.5,-8; 50 6,-8; 76 6,8; 77 5.5,8; 78 5,8; 79 4.5,8; 80 4,8; 81 3.5,8; 82 3,8; 83 2.5,8; 84 2,8; 85 1.5,8; 86 1,8; 87 0.5,8; 88 0,8; 89 -0.5,8; 90 -1,8; 91 -1.5,8; 92 -2,8; 93 -2.5,8; 94 -3,8; 95 -3.5,8; 96 -4,8; 97 -4.5,8; 98 -5,8; 99 -5.5,8; 100 -6,8
SO8 = smd 0.6 x 2.2: 1 -1.905,-2.6; 2 -0.635,-2.6; 3 0.635,-2.6; 4 1.905,-2.6; 5 1.905,2.6; 6 0.635,2.6; 7 -0.635,2.6; 8 -1.905,2.6
SOT23-5' = smd 0.6 x 1.2: 1 -0.95,-1.306; 2 0,-1.306; 3 0.95,-1.306; 4 0.95,1.306; 5 -0.95,1.306
7395-03 = drill 1.016 long: 1 2.54,0; 2 0,0; 3 -2.54,0
520426-4 = drill 0.889: 1 -4.445,6.35; 2 -3.175,8.89; 3 -1.905,6.35; 4 -0.635,8.89; 5 0.635,6.35; 6 1.905,8.89; 7 3.175,6.35; 8 4.445,8.89 | hole 3.251: -5.715,0; 5.715,0
DC_POWER_INPUT_2.1MM = drill 3.5: P1 8.5,0 | drill 3: P2 2.5,0; P3 5.55,-4.9
IND_LPS4012 = smd 0.81 x 3.04: 1 -2.2,0; 2 2.2,0
R0805 = smd 1.3 x 1.5: 1 -0.95,0; 2 0.95,0
OSCILLATOR_3.2X2.5 = smd 0.9 x 1.1: P$1 -1.05,-1; P$2 1.05,-1; P$3 1.05,1; P$4 -1.05,1
MA03-2 = drill 1.016: 1 -2.54,-1.27 | drill 1.016 octagon: 2 -2.54,1.27; 3 0,-1.27; 4 0,1.27; 5 2.54,-1.27; 6 2.54,1.27
SOT323 = smd 0.7 x 0.7: 1 -0.65,-0.925; 2 0.65,-0.925; 3 0,0.925
SOT223 = smd 1.219 x 2.235: 1 -2.311,-3.099; 2 0,-3.099; 3 2.311,-3.099 | smd 3.6 x 2.2: 4 0,3.099
SOT323-BEC = smd 0.6 x 1: B -0.65,-0.9; C 0,0.9; E 0.65,-0.9
R0402 = smd 0.7 x 0.9: 1 -0.65,0; 2 0.65,0
R1210 = smd 1.6 x 2.7: 1 -1.4,0; 2 1.4,0
R2512 = smd 1.8 x 3.2: 1 -2.8,0; 2 2.8,0
LED_HAND = smd 1.2 x 0.8: A -1,0; K 1,0
LED_PIPE_7513D2-L = hole 1.93: -1.486,0; 1.486,0
240-0002-1 = smd 0.5 x 2: P$1 -1.6,8.65; P$2 -0.8,8.65; P$3 0,8.65; P$4 0.8,8.65; P$5 1.6,8.65 | drill 1.5: SHIELD_1 -3.65,3.1; SHIELD_2 3.65,3.1; SHIELD_3 3.65,8.4; SHIELD_4 -3.65,8.4 | hole 1: -1.75,6.4; 1.75,6.4
CON_3.5MM_1X2 = drill 1.2 octagon: P1 -1.75,0; P2 1.75,0
CON_3.5MM_1X4 = drill 1.2 octagon: P1 -5.25,0; P2 -1.75,0; P3 1.75,0; P4 5.25,0
CON_3.5MM_1X3 = drill 1.2 octagon: P1 -3.5,0; P2 0,0; P3 3.5,0

### Placement (x,y rotation side)
C1  11,74.5 90 top
C2  5.9,74.02 90 bottom
C3  21,64 90 top
C4  11.05,80.35 90 top
C5  11.92,51.88 90 top
C6  24.22,46.84 0 top
C7  15.71,45.9 180 top
C8  27.3,77.65 90 top
C9  31.5,77.65 90 top
C10  28.05,54.54 0 top
C11  14.21,40.93 270 top
C12  9.09,41.61 0 top
C13  15.08,43.51 180 top
C14  27.25,74.75 0 bottom
C15  29.28,38.3 0 top
C16  29.33,50.75 90 top
C17  34,75 270 bottom
C18  31.5,74.6 180 bottom
C19  70.35,52.2 90 top
C20  48.22,55.67 90 top
C21  35.5,41.25 180 top
C22  35.5,36 180 top
C23  44,31 270 top
C24  49,31.12 270 top
C25  36.11,46.65 90 top
C26  56.5,37 0 top
C27  43,52 90 top
C28  56.5,42 0 top
C29  38.75,50.75 90 top
C30  56.5,47 0 top
C31  48.5,52 90 top
C32  31.25,50.5 90 top
C33  62.75,14.75 180 bottom
C34  48.55,73.74 270 top
C35  42.85,80.87 0 top
C36  62.5,7.62 180 bottom
C37  51.15,74.2 90 bottom
C38  48.53,62.29 270 top
C39  77.25,4.5 0 bottom
C40  42.86,69.96 0 top
C41  70.25,5 90 bottom
C42  65.75,5 270 bottom
C43  51.15,63.25 90 bottom
C44  12.75,22.65 270 top
C45  23.83,21.35 90 top
C46  29.5,21.75 270 top
C47  40.25,21.36 90 top
C48  46.04,22.64 270 top
C49  56.88,21.34 90 top
CLKIN  5.96,30.36 0 top
CTUNE  22.75,73.85 270 bottom
CUSB  7.88,54.22 180 top
D1  27,15.5 270 bottom
D2  43.5,15.5 270 bottom
D3  60,15.5 270 bottom
D4  61.38,21.75 180 top
F1  13.7,71.25 270 bottom
IC1  17.44,48.36 270 top
IC2  18,77.5 270 top
IC3  26.27,51.24 180 top
IC4  22.45,40.59 90 top
IC5  29.5,68.5 180 bottom
IC6  73,50.25 0 top
IC7  46,41.5 0 top
IC8  42.86,76 0 top
IC9  62.5,11 180 bottom
IC10  OPA365  [SOT23-5']  80.76,5.95 180 bottom
IC11  42.86,64.67 0 top
IC12  15.54,22 0 top
IC13  21,22 180 top
IC14  32.05,22 0 top
IC15  37.5,22 180 top
IC16  48.53,22 0 top
IC17  54,22 180 top
J1  82,51.5 90 top
J2  20,8 0 top
J3  36.5,8 0 top
J4  53,8 0 top
JACK  5.19,66.58 0 top
L1  6,76.05 90 top
L2  21.48,51.72 270 top
L3  38.65,80.04 90 top
L4  38.65,69.06 90 top
OSC1  45.06,56.02 180 top
PDI  54.68,55.39 0 top
Q1  51.8,74 0 top
Q2  68.7,75.5 270 top
Q3  51.8,62.74 0 top
Q4  68.7,64.23 270 top
Q5  72.33,39.38 270 top
Q6  71.96,18.84 270 top
Q7  71.5,41 90 bottom
Q8  71.5,20.5 90 bottom
Q9  72.32,32.13 270 top
Q10  71.96,11.83 270 top
Q11  71.5,34 90 bottom
Q12  71.5,13.5 90 bottom
Q13  42.35,26.95 0 top
Q14  60,26.88 0 top
Q15  23.99,27.6 0 bottom
Q16  20.15,7.96 180 bottom
Q17  36.5,8 180 bottom
Q18  53,8 180 bottom
R1  17,70.5 180 top
R2  20.5,80 270 bottom
R3  10.5,36.53 180 top
R4  10.48,38.77 180 top
R5  35.5,75 90 bottom
R6  34,72 90 bottom
R7  76.65,51.5 180 top
R8  7.44,20.22 0 top
R9  46.99,73.73 90 top
R10  38.12,55.75 0 bottom
R11  50.5,72.1 180 bottom
R12  50.4,77.7 0 top
R13  81,9.5 0 bottom
R14  81,11 180 bottom
R15  46.97,62.3 90 top
R16  73.8,5.7 0 bottom
R17  38.12,53.96 0 bottom
R18  68,5 270 bottom
R19  50.43,66.65 0 top
R20  50.5,60.65 180 bottom
R21  67.94,40.01 0 top
R22  68.53,19.47 0 top
R23  73.22,42.36 270 top
R24  72.89,21.9 270 top
R25  83,41 0 bottom
R26  83,20.5 0 bottom
R27  67.98,32.73 0 top
R28  68.51,12.48 0 top
R29  73.22,35.34 270 top
R30  72.86,14.87 270 top
R31  83,37.5 0 bottom
R32  83,17 0 bottom
R33  43.25,24 90 top
R34  60.99,24.05 90 top
R35  23.25,25.75 90 top
R36  24.75,25.75 90 top
R37  41.5,24 90 top
R38  59.12,23.5 90 top
R39  13.5,15 90 bottom
R40  20.25,27.5 0 top
R41  30,15 90 bottom
R42  36.7,25.92 0 top
R43  46.5,15 90 bottom
R44  53.25,26.25 180 top
R45  14.02,11.08 180 bottom
R46  30.54,11.08 180 bottom
R47  47.03,11.08 180 bottom
RI1  60.98,76 270 top
RI2  56,76 90 top
RI3  60.98,64.67 270 top
RI4  56,64.67 90 top
RTRIM  20.6,72.3 90 bottom
RTUNE  20.6,75.4 90 bottom
RUSB  3.87,54.2 0 top
RX  14.53,38.77 0 top
STATE  7.21,15.51 270 top
TX  14.53,36.53 0 top
U$1  [LED_PIPE_7513D2-L]  7.21,10.11 90 top
U$2  [FIDUCIAL]  82.5,26.5 0 top
U$3  [FIDUCIAL]  74.5,78.5 0 top
U$4  [FIDUCIAL]  7.5,23.5 0 top
U$5  [FIDUCIAL]  7.5,23.5 0 bottom
U$6  [FIDUCIAL]  82.5,26.5 0 bottom
U$7  [FIDUCIAL]  74.5,78.5 0 bottom
U$9  [LOGO_6]  63.33,54.25 0 top
USB  0.13,47.96 270 top
X1  79,75.5 270 top
X2  79,67.5 270 top
X3  72,8 180 top
X4  79,37.5 270 top
X5  79,17 270 top

### Tracks (layer width: path | path; a pad name or v marks a point on that pad's centre or on a via)
5V_RAW  (via drill 0.35 pad 0.65)
  Top 0.254: IC3.3 v24.27,52.65 v24.26,52.64 | v28.2,52.64 27.22,52.64 IC3.1
  Top 0.305: 16.31,41.56 C11.1 | v20.78,41.55 IC4.20 | R3.2 9.83,36.55 R4.2 9.84,38.79 9.84,41.45 9.7,41.59 10.56,41.59 C12.+ | v23.43,49.06 23.43,52.07 22.85,52.65 21.49,52.65 L2.1 | IC3.1
  Top 0.406: IC4.20 16.31,41.56 10.61,41.56 C12.+ | L2.1 21.54,52.72
  Top 0.508: IC3.1 C10.1 | 27.16,54.5 C10.1 | 27.25,54.59 C10.1
  Top 0.61: C10.1 22.05,54.55 21.45,53.95 21.45,52.69 L2.1
  Bottom 0.254: v24.26,52.64 v28.2,52.64
  Bottom 0.305: v23.43,49.06 23.43,41.96 23.06,41.57 22.7,41.57 v20.78,41.55
+5V  (via drill 0.35 pad 0.65)
  Top 0.305: C47.1 IC15.5 | IC17.5 57.13,20.7 C49.1 | IC13.5 C45.1 | R36.1 v24.75,20.7 | R37.1 41.5,20.79 v41.41,20.7 | R38.1 59.12,20.95 58.86,20.69 v58.23,20.69 v58.22,20.69 | C19.1 IC6.5
  Top 0.406: C45.1 v24.75,20.7 | v58.22,20.69 57.14,20.69 C49.1 | J2.4 20.39,16.89 20.75,17.25 20.75,20.45 v21,20.7 | v37.5,20.7 37.5,17.38 37,16.88 35.88,16.88 J3.4 | C47.1 41.23,20.71 v41.41,20.7 | J4.4 53.39,16.89 53.75,17.25 53.75,20.45 v54,20.7 | v61.5,15.75 v61.5,20.5 | IC6.5 72.05,58.17 v72.25,58.38
  Top 0.61: 37,79 37,68.25 37.15,68.11 L4.1 | 37,79 37,82.5 v37.25,82.75 | L3.1 37.09,79.09 37,79
  Top 0.813: v66.65,43.31 R23.1 75.06,43.31 75.25,43.5 | v75.25,45 75.25,43.5 | 75.25,43.5 75.25,36.5 75.04,36.29 R29.1 v66.66,36.29 v66.65,36.29 | v66.72,22.85 66.92,22.85 R24.1 75.1,22.85 75.25,23 | 68.75,15.82 R30.1 75.25,15.82 | 68.75,15.82 67.52,15.82 | 75.25,15.82 75.25,23 | 75.25,23 75.25,23.75 v75.5,24 | X3.P1 77.25,14.82 76.25,15.82 75.25,15.82 | v1.75,56.5 30.5,56.5 31,57 31,62 31.5,62.5 33,62.5 33.5,63 33.5,68.5 v33,69 v32,69 v31,69 | v66.64,15.83 68.74,15.83 68.75,15.82
  Bottom 0.254: IC9.3 63.46,12.42 66.42,12.42 66.64,12.64 v66.64,15.83 | IC5.P$4 30.77,74.48 C18.1 | 35.5,82.75 R5.2 C17.1
  Bottom 0.305: IC9.1 61.55,14.4 C33.1 | 30.92,75.65 30.77,75.5
  Bottom 0.406: 60.72,20.7 v54,20.7 v41.41,20.7 v37.5,20.7 v24.75,20.7 v21,20.7 IC13.5 | 60.72,20.7 v58.22,20.69 | C33.1 61.9,15.35 v61.5,15.75 | 60.72,20.7 61.3,20.7 v61.5,20.5 | v72.25,58.38 86,58.38 86.25,58.75 | 82.04,54 J1.1
  Bottom 0.61: v21,20.7 6.1,20.7 5.55,21.25 5.55,26.25 4.8,27 2.25,27 1.5,27.75 1.5,56.25 v1.75,56.5
  Bottom 0.813: 86.25,54 86.25,58.75 86.25,78.75 85.75,79.25 83.25,79.25 82.75,79.75 82.75,81.75 81.75,82.75 v37.25,82.75 35.5,82.75 31.25,82.75 30.77,82.27 30.77,75.5 IC5.P$4 30.77,69.23 v31,69 v33,69 | 86.25,49.25 86.12,49.12 86.25,54 | 86.25,54 82.04,54 | 86.25,46 85.5,45.25 75.5,45.25 v75.25,45 | 86.25,46 86.25,54 | v66.65,36.29 68.29,36.29 Q11.3 | v66.65,43.31 68.29,43.31 Q7.3 | v66.72,22.85 68.36,22.85 Q8.3 | Q12.3 68.38,15.83 v66.64,15.83 | v75.5,24 85.75,24 86.25,24.5 86.25,46
+12V  (via drill 0.35 pad 0.65)
  Top 0.254: L1.1 6,73.5 6.5,73
  Bottom 0.254: C2.+ 5.9,72.1 6,72
  Bottom 0.406: J2.6 21.91,18.66 | D1.C 27,18.75 | J3.6 38.41,18.66 38.5,18.75 | D2.C 43.5,18.75 | J4.6 54.91,18.66 55,18.75 | D3.C 60,18.75
  Bottom 0.61: 60,18.75 55,18.75 43.5,18.75 38.5,18.75 27,18.75 22,18.75 | 21.91,18.66 22,18.75 | 22,18.75 4.5,18.75 4.25,19 4.25,25.25 3.75,25.75 1,25.75 0.62,26.25 0.62,71.62 1.1,72.1 F1.1
  other vias: 14.15,73.75 13.05,73.75 14.15,72.95 13.05,72.95
  pour Top (no thermals): 4.5,74 14.5,74 14.5,71.5 12.5,71.5 12.5,72 4.5,72
  pour Bottom (no thermals): 4.5,74 14.5,74 14.5,71.5 12.5,71.5 12.5,72 4.5,72
ADC0  (via drill 0.35 pad 0.65)
  Top 0.254: IC7.95 42.5,47.75 v42.25,47.5 | v63.25,47.5 63.46,47.29 63.46,5.04 v63.5,5
  Bottom 0.254: R18.2 C42.2 65.35,4.35 64.7,5 v63.5,5 | v42.25,47.5 v63.25,47.5
ADC0_IN
  Bottom 0.203: R13.2 79.2,9.5 79,9.3 79,6.7 78.8,6.5 70.5,6.5 70.2,6.8 70.2,7.95 X3.P3
C_M0  (via drill 0.35 pad 0.65)
  Top 0.305: IC8.2 42.23,75.72 v42.5,76 | v61,75.5 61,73.22
  Top 0.406: 61,73.22 RI1.2
  Top 1.016: Q2.3 60.99,73.19 RI1.2
  Bottom 0.305: v42.5,76 60.5,76 v61,75.5
C_M1  (via drill 0.35 pad 0.65)
  Top 0.203: 60.34,61.92 60.32,61.94 | 60.77,61.94 RI3.2
  Top 0.254: 60.77,61.94 60.37,61.94 60.34,61.92 | 61,61.89 61.07,61.89 61.1,61.92
  Top 0.305: IC11.2 42.23,64.41 v42.48,64.67 | v61,64.5 61,61.89 RI3.2
  Top 0.406: 65.65,61.87 Q4.3 | RI3.2 60.84,62.34 61,62.5 61,62.03 RI3.2
  Top 1.016: Q4.3 61.1,61.92
  Bottom 0.305: v42.48,64.67 60.83,64.67 v61,64.5
CLK_IN  (via drill 0.35 pad 0.65)
  Top 0.254: IC7.21 33.25,37.5 33,37.25 33,33.75 v32.75,33.5 | v14.16,33.29 CLKIN.4
  Bottom 0.254: v32.75,33.5 14.38,33.5 v14.16,33.29
CTRL_BL
  Top 0.406: IC11.6 43.5,67.62 43.5,66.38 44.15,65.72 48.37,65.72 R19.1
CTRL_BL1
  Top 0.406: IC8.6 43.49,77.5 44,77 48.5,77 R12.1
DAC0  (via drill 0.35 pad 0.65)
  Top 0.254: IC7.8 35,44 34.75,44.25 34.75,48.88 35.5,49.62 35.5,61.12 v35.38,61.25 | R15.1 46.4,61.65 v46,61.25
  Bottom 0.254: v46,61.25 v35.38,61.25
DAC1  (via drill 0.35 pad 0.65)
  Top 0.254: IC7.7 35.5,44.5 35.25,44.75 35.25,48.62 36,49.38 v36,72.88 | R9.1 46.33,73.08 v46,72.75
  Bottom 0.254: v46,72.75 36,72.75 v36,72.88
DCIN
  Top 0.305: 16.35,79.05 16.5,79.2
  Top 0.508: R1.2 16.35,79.05
  Top 1.27: IC2.P2 16.5,79.2 11.3,79.2 C4.1
  Bottom 0.254: IC2.P2 20.35,79.2 R2.2
  pour Top (no thermals): 12.5,80 12.5,78 4.5,78 4.5,80
DI_PK0
  Top 0.254: J2.1 15.55,20.14 IC12.2
  Bottom 0.254: R39.1 J2.1
DI_PK1
  Top 0.254: J3.1 IC14.2
  Bottom 0.254: R41.1 J3.1
DI_PK2
  Top 0.254: IC16.2 48.52,14.38 J4.1
  Bottom 0.254: R43.1 J4.1
DIO_PK0  (via drill 0.35 pad 0.65)
  Top 0.254: J2.2 16.82,17.82 17.5,18.5 v17.5,28.25 | v24.75,28.5 R36.2
  Bottom 0.254: v17.5,28.25 17.8,28.53 Q15.3 24.72,28.53 v24.75,28.5
DIO_PK1  (via drill 0.35 pad 0.65)
  Top 0.254: J3.2 33.33,17.57 34,18.25 v34,24.5 | R37.2 v40.39,24.65 v40.38,24.66 40.38,27.72 40.54,27.88 Q13.3
  Bottom 0.254: v40.39,24.65 34.15,24.65 v34,24.5
DIO_PK2  (via drill 0.35 pad 0.65)
  Top 0.254: J4.2 49.83,17.57 50.5,18.25 v50.5,24.25 | R38.2 v58.02,24.15 58,24.18 58,27.62 58.17,27.8 Q14.3
  Bottom 0.254: v58.02,24.15 50.65,24.15 v50.5,24.25
DO0
  Bottom 0.406: X5.P2 R32.2 | 75,13.5 74,13.5
  Bottom 1.016: Q12.2 74,13.5 Q12.4 | 75,13.5 75,16.5 75.5,17 X5.P2
DO1
  Bottom 0.406: R26.2 X5.P1
  Bottom 1.016: Q8.2 Q8.4 X5.P1
DO2
  Bottom 0.406: X4.P2 R31.2
  Bottom 1.016: Q11.2 Q11.4 74.6,37.1 75,37.5 X4.P2
DO3
  Bottom 0.406: R25.2 X4.P1
  Bottom 1.016: Q7.2 Q7.4 X4.P1
DO_PK0
  Top 0.305: J2.3 18.09,19.09 18.09,20.3 18.5,20.7 IC13.4
DO_PK1
  Top 0.305: J3.3 34.59,20.38 34.92,20.71 IC15.4
DO_PK2
  Top 0.305: J4.3 51.09,20.41 51.38,20.7 IC17.4
FT_CTS  (via drill 0.35 pad 0.65)
  Top 0.254: IC7.75 54,48 v53.75,48.25 | 26.09,42.87 IC4.11 28.51,42.86 28.75,43.11 v28.75,48
  Top 0.305: 26.09,42.88 IC4.11
  Bottom 0.254: v53.75,48.25 29,48.25 v28.75,48
FT_RTS  (via drill 0.35 pad 0.65)
  Top 0.254: IC7.71 55.5,45.5 v56,45 | v32.5,38 v32.5,44.75
  Top 0.305: v23.55,37.66 IC4.3
  Bottom 0.254: v23.55,37.66 32.16,37.66 v32.5,38 | v56,45 32.75,45 v32.5,44.75
FT_RXD  (via drill 0.35 pad 0.65)
  Top 0.254: IC7.48 51,35.5 v50.75,35.75 | IC4.5 27.5,38.96 v27.63,39.08 | v31.88,39.5 31.88,35.25 v32,35.12
  Top 0.305: 26.12,38.93 IC4.5
  Top 0.406: 26.09,38.96 IC4.5
  Bottom 0.254: v50.75,35.75 41.5,35.75 40.75,35 32.12,35 v32,35.12 | v31.88,39.5 28.05,39.5 v27.63,39.08
FT_TXD  (via drill 0.35 pad 0.65)
  Top 0.254: IC7.47 50.5,34.75 v50.25,35 | 26.06,36.39 26.06,34.33 v26.27,34.12
  Top 0.406: 26.06,36.39 IC4.1
  Bottom 0.254: v50.25,35 50.25,34.75 50,34.5 31.5,34.5 31.1,34.1 26.29,34.1 v26.27,34.12
GND  (via drill 0.35 pad 0.65)
  Top 0.305: IC1.P$2 14.44,48.36 v14.4,48.32
  Bottom 0.508: 29.5,72 29.5,65.5
  other vias: 18.92,46.12 5.85,54.24 5.85,53.02 11.89,53.78 26.09,46.85 13.84,45.86 13.13,43.59 15.5,40.25 5.38,42.33 5.38,40.88 5.16,20.04 54.99,63.55 56.99,63.55 55.99,63.55 53.57,61.87 58.47,61.93 54.99,74.89 56.99,74.89 55.99,74.89 53.59,73.2 58.46,73.22 49.88,73.19 49.77,61.66 45.86,73.67 45.83,62.43 43.52,70.98 43.5,81.82 34.88,40.14 33.75,35.99 44.01,29.14 49.01,29.75 58.35,36.99 58.35,41.98 58.35,46.74 48.52,53.84 42.98,53.85 46.51,35.14 39.16,22.01 55.86,22.06 22.76,22.03 29.8,37.04 36.56,48.88 37.68,51.42 70.29,54.1 29.31,52.89 31.22,52.36 30.1,54.56 48.23,57.35 46.51,38.14 72.09,47.43 73.97,47.43 45.98,19.81 29.48,19.93 12.73,19.88 64.51,6.26 64.36,13.43 64.36,16.06 40.88,39.01 51.13,39.76 42.01,44.14 51.13,44.14 56.86,11.81 56.86,10.43 40.48,11.81 40.48,10.31 24.11,10.31 24.11,11.81 42.73,57.1 84.13,30.26 84.13,28.26 84.13,26.26 55.63,50.26 79.85,28.26 81.63,30.26 79.13,30.26 76.63,30.26 71.63,26.26 69.13,26.26 69.13,28.26 71.63,28.26 81.53,33.96 84.03,33.96 83.23,14.46 83.23,12.46 58.63,50.26 61.63,50.26 42.75,55.29 36.63,56.76 40.26,54.89 36.63,51.76 32.13,56.76 36.98,63.26 34.67,25.5 43.13,19.76 59.13,19.76 52.13,19.76 26.13,19.76 19.13,19.76 7.41,26.67 8.89,22.2 11.63,25.76 60.13,41.26 60.13,38.76 60.13,36.26 57.13,39.26 56.63,30.76 59.13,30.76 65.63,68.26 71.63,67.25 71.63,79.26 65.63,79.26 84.13,77.76 84.13,75.26 84.13,72.76 84.13,69.76 84.13,67.26 84.13,64.76 84.13,62.26 60.03,10.86 75.43,4.56 79.33,11.01 80.73,8.51 71.53,4.61 5.13,77.26 6.63,77.26 10.98,77.36 8.83,82.51 8.83,81.01 28.48,65.81 30.48,65.81 30.48,64.31 28.48,64.31 32.48,65.81 32.48,64.31 32.48,67.31 30.48,67.31 28.48,67.31 26.48,67.31 26.48,65.81 26.48,64.31 19.48,78.31 20.48,78.31 19.98,77.56 8.83,75.91 25.08,74.76 29.43,79.06 29.43,80.56 26.43,80.56 32.43,80.56 13.48,16.88 29.98,16.88 46.48,16.88 57.16,5.54 49.16,5.54 40.66,5.54 32.16,5.54 24.16,5.54 15.66,5.54 44.66,5.54 28.16,5.54 11.66,5.54 34.03,70.21 51.65,24.84 32.13,46.14 70.36,68.26
  pour Bottom (rank 2): 64.11,-0.06 83.5,-0.06 83.5,10.5 87,10.5 87,80 83.5,80 83.5,83.5 3.5,83.5 3.5,73.5 0,73.5 0,25 3.5,25 3.5,3.5 64.11,3.5
  pour Top (rank 2): 83.5,-0.06 83.5,10.5 87,10.5 87,80 83.5,80 83.5,83.5 3.5,83.5 3.5,73.5 0,73.5 0,25 3.5,25 3.5,3.5 64.11,3.5 64.11,-0.06
I_OFF_DAC0  (via drill 0.35 pad 0.65)
  Top 0.254: IC7.11 34,42.5 33.75,42.75 33.75,54.25 | 33.75,54.25 33.75,60.12 v33.62,60.25 | v34,54.12 33.88,54.12 33.75,54.25
  Bottom 0.254: 48.5,60.5 49.7,60.5 R20.1 | 48.5,60.5 33.88,60.5 v33.62,60.25 | 48.41,60.54 48.5,60.5 | R17.2 34.16,53.96 v34,54.12
I_OFF_DAC1  (via drill 0.35 pad 0.65)
  Top 0.254: IC7.10 34.5,43 34.25,43.25 34.25,49.38 34.75,49.88 v34.75,55.88 34.75,61.62 35.5,62.38 35.5,71.5 v35,72
  Bottom 0.254: v35,72 35.1,72.1 R11.1 | R10.2 35,55.75 v34.75,55.88
LED_5V_0  (via drill 0.35 pad 0.65)
  Top 0.406: IC8.7 42.23,80.85 C35.1 40.01,80.87 v40,80.88 | 38.65,80.87 L3.2
  Top 0.813: 38.65,80.87 39.99,80.87 v40,80.88
  Bottom 0.813: v40,80.88 78,80.88 79,79.88 X1.P1
LED_5V_1  (via drill 0.35 pad 0.65)
  Top 0.305: 42.23,69.99 C40.1
  Top 0.406: 38.66,69.99 L4.2 | IC11.7 42.23,69.92 C40.1 42.17,70 v40,70
  Top 0.813: 38.66,69.99 v39.99,69.99 v40,70
  Bottom 0.813: v40,70 78.25,70 X2.P1
LED_DATA  (via drill 0.35 pad 0.65)
  Top 0.254: IC7.20 33.75,38 33.25,38.5 33.25,59 33,59.25 v33,59.5 | IC6.2 73,59 v72.5,59.5
  Bottom 0.254: v72.5,59.5 v33,59.5
LED_RTN0
  Top 1.016: Q2.2 Q2.4 73.55,73.75 X1.P2
LED_RTN1
  Top 1.016: Q4.2 Q4.4 73.32,65.75 X2.P2
N$1
  Top 0.406: Q4.1 64.15,66.54 63.11,65.5 52.65,65.5 R19.2 51.8,66.35 Q3.3
N$2
  Bottom 0.254: Q16.1 14.68,11.06 R45.2
N$3  (via drill 0.35 pad 0.65)
  Top 0.305: R24.2 72.89,18.86 Q6.C 72.86,18.28 v73.03,18.2
  Bottom 0.305: Q8.1 72.92,18.19 72.86,18.25 72.86,18.28 v73.03,18.2
N$4
  Bottom 0.254: Q17.1 31.21,11.1 R46.2
N$5
  Top 0.305: Q6.B 69.2,19.49 R22.2
N$6
  Bottom 0.254: Q18.1 47.71,11.1 R47.2
N$7  (via drill 0.35 pad 0.65)
  Top 0.305: R29.2 73.24,34.28 73.22,34.28 Q9.C 73.22,31.44 v73.43,31.15
  Bottom 0.254: 73.22,31.36 v73.43,31.15
  Bottom 0.305: Q11.1 72.89,31.69 v73.43,31.15
N$8
  Top 0.305: 68.64,32.78 R27.2 68.67,32.78 Q9.B
N$9  (via drill 0.35 pad 0.65)
  Top 0.305: v73.02,11.12 72.86,11.31 Q10.C 72.99,11.83 72.99,13.79 R30.2
  Bottom 0.305: Q12.1 72.22,11.19 Q10.C 72.86,11.15 v73.02,11.12
N$10
  Top 0.305: Q10.B R28.2
N$11
  Top 0.406: R12.2 51.8,77 | 51.8,77 Q1.3 | 62.5,76.89 51.91,76.89 51.8,77 | Q2.1 64.1,77.81 63.18,76.89 62.5,76.89 | 62.5,76.89
N$12
  Bottom 0.254: RTRIM.2 22.5,72.95 CTUNE.2
  Bottom 0.305: IC2.P5 18.7,74.1 19.85,72.95 RTRIM.2
N$13
  Top 0.305: IC6.4 76.05,51.55 R7.2
N$14
  Bottom 0.254: RTUNE.1 22.38,74.75 CTUNE.1
N$15
  Top 0.254: R9.2 C34.1
  Top 0.305: R9.2 46.99,74.87 46.61,75.25 43.98,75.25 43.54,74.81 43.54,73.42 IC8.3
N$16
  Bottom 0.254: IC2.P1 20.25,80.9 R2.1
N$18
  Bottom 1.27: F1.2 JACK.P1
N$20
  Bottom 0.305: C17.2 R5.1 | C17.2 34,74 33.5,73.5 32.5,73.5 32.04,73.04 IC5.P$5 | R6.2 C17.2
N$21
  Top 0.254: C38.1 46.98,62.94 R15.2
  Top 0.305: 46.98,63.02 R15.2 46.98,62.97 46.98,63.46 46.57,63.87 43.89,63.87 43.48,63.46 43.48,61.9 IC11.3
N$22
  Top 1.016: RI1.1 RI2.2
N$23
  Top 0.254: R8.1 6.79,16.93 STATE.A
N$24
  Top 0.508: R1.1 20.5,70.5 21,70 C3.+
N$25  (via drill 0.35 pad 0.65)
  Top 0.305: R23.2 73.23,41.72 Q5.C 73.23,38.34 v73.33,38.18
  Bottom 0.305: Q7.1 72.83,38.69 v73.33,38.18 73.23,38.28
N$27
  Top 0.305: Q5.B 68.6,40.02 R21.2
N$28  (via drill 0.35 pad 0.65)
  Top 0.254: v52.1,72.2 52,72.1 51.3,72.1 51.15,72.25 Q1.1
  Bottom 0.254: C37.1 R11.2 52,72.1 v52.1,72.2
N$30  (via drill 0.35 pad 0.65)
  Top 0.254: v52.25,60.75 51.4,60.75 51.15,61 Q3.1
  Bottom 0.254: R20.2 C43.1 51.15,60.85 51.25,60.75 v52.25,60.75
N$38
  Top 0.305: 16.04,43.51 C13.1
  Top 0.356: IC4.17 16.04,43.51
N$39
  Top 0.305: IC1.P$5 20.92,48.36 21.64,49.09 21.64,50.36 21.01,50.99 21.49,50.99 L2.2 | 9.66,49.49 8.83,49.51 USB.P$1 | C5.1 11.92,51.12
  Top 0.406: 21.01,50.99 11.79,50.99 | 11.79,50.99 11.16,50.99 9.66,49.49 | 11.92,51.12 11.79,50.99
N$40
  Top 0.254: IC1.P$1 14.39,49.31 13.92,48.84 8.87,48.84
  Top 0.305: 8.81,48.78 USB.P$2 8.87,48.84
N$45
  Top 1.016: RI3.1 RI4.2
N$47
  Top 0.305: RX.A R4.1
N$48
  Top 0.305: IC4.23 17.89,39.61 17.58,39.31 17.58,38.04 16.05,36.51 15.54,36.51 TX.K
N$49
  Top 0.305: IC4.22 17.52,40.26 16.82,39.56 16.82,39.31 16.31,38.8 15.55,38.8 RX.K
N$50
  Top 0.254: IC1.P$3 14.35,47.41 13.82,47.94 8.8,47.94
  Top 0.305: 8.81,47.93 USB.P$3 8.8,47.94
N$56
  Bottom 0.254: R18.1 C41.2 73.1,5.65 R16.2
N$58
  Bottom 0.254: IC10.4 81.69,4.26 81.69,5.27 81.26,5.7 79.51,5.7 | 79.8,6.85 IC10.1 79.81,6 79.51,5.7 | R16.1 79.51,5.7
N$59
  Top 0.305: 8.51,51.63 USB.SHIELD_4
  Top 0.406: CUSB.1 8.51,51.63
N$61
  Top 0.305: 3.22,51.62 USB.SHIELD_1
  Top 0.406: RUSB.1 3.22,51.62
N$62
  Top 0.305: TX.A R3.1
N$64
  Bottom 0.254: R14.2 R13.1 81.71,8.94 81.71,6.85 IC10.3
OSC1
  Top 0.254: IC7.92 44,55.51
  Top 0.305: 44,55.51 OSC1.P$3
P5.45V  (via drill 0.35 pad 0.65)
  Top 0.813: C8.1 v26.7,76.25
  Top 1.27: C9.1 v26.7,76.25 v28,76.25 C8.1 19.45,76.25 19,75.8 IC2.P4
  Bottom 0.254: RTUNE.2 18.25,76.05 IC2.P4
  Bottom 0.61: C14.1 28.23,74.88 IC5.P$2 IC5.P$1
  Bottom 0.813: v26.7,76.25 28.25,76.25 | 28.23,74.88 28.23,76.02 v28,76.25
PDI-CLK  (via drill 0.35 pad 0.65)
  Top 0.305: IC7.90 45,52.5 v45.5,53
  Bottom 0.305: v45.5,53 56.75,53 57.22,53.47 PDI.5
PDI-DATA  (via drill 0.35 pad 0.65)
  Top 0.305: IC7.89 45.5,51.5 v46,52 | PDI.1 52.14,52.39 51.75,52 v51,52
  Bottom 0.305: v46,52 v51,52
PK0_IN  (via drill 0.35 pad 0.65)
  Top 0.254: IC7.29 41.5,32.25 v41.25,32 | v16.5,31.75 IC12.4
  Bottom 0.254: v41.25,32 16.75,32 v16.5,31.75
PK0_IO  (via drill 0.35 pad 0.65)
  Top 0.254: IC7.30 42,31.5 v41.75,31.25 | R35.2 22.35,26.4 22.25,26.5 v22.25,26.75 22.25,27.25 22.25,31 v22.5,31.25
  Bottom 0.254: v41.75,31.25 v22.5,31.25 | Q15.2 22.32,26.68 v22.25,26.75
PK0_OUT  (via drill 0.35 pad 0.65)
  Top 0.254: IC7.31 42.5,30.75 v42.25,30.5 | IC13.2 21,27.5 | 21,27.5 21,30.25 v21.25,30.5 | R40.2 21,27.5
  Bottom 0.254: v42.25,30.5 v21.25,30.5
PK0_VAL  (via drill 0.35 pad 0.65)
  Top 0.254: IC7.32 43,30 v42.75,29.75 | v10.5,29 10.5,13.59 v10.26,13.33
  Bottom 0.254: v42.75,29.75 15,29.75 14.38,29.12 10.62,29.12 v10.5,29 | R45.1 10.47,11.08 10.25,11.3 10.25,13.07 v10.26,13.33
PK1_IN  (via drill 0.35 pad 0.65)
  Top 0.254: IC7.39 46.5,28.75 v46.25,28.5 | IC14.4 33,28.25 v33.25,28.5
  Bottom 0.254: v46.25,28.5 v33.25,28.5
PK1_IO
  Top 0.254: IC7.40 47,28 46.5,27.5 46.5,26 46.28,25.78 43.25,25.78 | R33.2 43.25,25.78 | 43.25,25.78 Q13.2
PK1_OUT  (via drill 0.35 pad 0.65)
  Top 0.254: IC7.41 47.5,27.25 v47.25,27 | IC15.2 37.5,26 | 37.5,26 37.5,26.75 v37.75,27 | R42.2 37.42,25.92 37.5,26
  Bottom 0.254: v47.25,27 v37.75,27
PK1_VAL  (via drill 0.35 pad 0.65)
  Top 0.254: IC7.42 48,26.5 v47.75,26.25 | v28,13.25 28,24 v28.25,24.25
  Bottom 0.254: v47.75,26.25 30.75,26.25 30.5,26 30.5,24.5 30.25,24.25 v28.25,24.25 | v28,13.25 28,11.35 28.3,11.05 29.86,11.05 R46.1
PK2_IN  (via drill 0.35 pad 0.65)
  Top 0.254: IC7.49 51.5,27.25 v51.25,27 | IC16.4 49.48,26.73 v49.75,27
  Bottom 0.254: v49.75,27 v51.25,27
PK2_IO  (via drill 0.35 pad 0.65)
  Top 0.254: R34.2 60.99,25.61 Q14.2 60.65,33.1 v60.25,33.5 | v52.75,33.5 IC7.50
  Bottom 0.254: v60.25,33.5 v52.75,33.5
PK2_OUT
  Top 0.254: IC7.51 54,26.25 | 54,26.25 IC17.2 | R44.1 54,26.25
PK2_VAL  (via drill 0.35 pad 0.65)
  Top 0.254: IC7.52 55.25,36 55.5,35.75 55.5,25.75 v55.25,25.5 | v44.93,25.15 v44.93,13.25
  Bottom 0.254: v55.25,25.5 45.28,25.5 v44.93,25.15 | R47.1 46.42,11.11 45.26,11.11 44.93,11.44 v44.93,13.25
SERIAL_LED0
  Top 0.305: R7.1 J1.2
STATE  (via drill 0.35 pad 0.65)
  Top 0.254: IC7.1 38,49.25 v37.75,49.5 | v10.25,32.5 9.78,32.03 9.78,20.49 9.5,20.22 R8.2 | v31.25,32.75 31.25,47 31.5,47.25 32.38,47.25 32.62,47.5 32.62,48.88 32.63,48.88 v32.63,49.42
  Bottom 0.254: v10.25,32.5 31,32.5 v31.25,32.75 | v37.75,49.5 32.71,49.5 v32.63,49.42
TOG_D00  (via drill 0.35 pad 0.65)
  Top 0.254: IC7.45 49.5,32.5 50,32 50,28.5 v50.25,28.25 | 67.84,12.5 65.62,12.5 65.38,12.75 65.38,28 65.12,28.25 v64.38,28.25
  Top 0.406: 67.84,12.5 R28.1
  Bottom 0.254: v50.25,28.25 v64.38,28.25
TOG_D01  (via drill 0.35 pad 0.65)
  Top 0.254: IC7.35 44.5,32.5 45,32 45,29.38 v45.25,29.12 | 66,28 66,19.87 66.4,19.47 R22.1 | v66,28.9 66,28 | 66,28
  Top 0.406: R22.1
  Bottom 0.254: v45.25,29.12 65.77,29.12 v66,28.9
TOG_D02  (via drill 0.35 pad 0.65)
  Top 0.254: IC7.25 38,33 v38.25,32.75 | v66.25,32.75 67.31,32.75 R27.1
  Bottom 0.254: v38.25,32.75 v66.25,32.75
TOG_D03  (via drill 0.35 pad 0.65)
  Top 0.254: R21.1 64.5,40.01 64.25,40.26 v64.25,43 | IC7.15 39.5,40.5 39.75,40.75 39.75,43 v40,43.25
  Bottom 0.254: v40,43.25 64,43.25 v64.25,43
USBDM
  Top 0.254: IC1.P$6 17.71,49.31 17.4,49 17.4,45.91 | 18.77,44.22 17.88,44.22 17.4,44.7 17.4,45.91 | C7.1 17.39,45.9 17.4,45.91
  Top 0.305: 18.77,44.22 IC4.16
USBDP
  Top 0.254: IC1.P$4 21.72,47.41 22.28,46.85 | 22.28,46.83 22.28,45.7 21.4,44.82 IC4.15 | C6.1 22.29,46.84
  Top 0.305: IC4.15 | 22.28,46.85 22.28,46.83 22.29,46.84
VAL_PK0
  Bottom 0.406: D1.A 23.23,14.4 J2.7
  Bottom 0.61: J2.7 23.18,13.68 22.5,13 20.5,13 20.16,12.66 Q16.2
  Bottom 1.016: Q16.4 Q16.2
VAL_PK1
  Bottom 0.406: D2.A 39.73,14.4 J3.7
  Bottom 0.61: Q17.2 36.5,12.5 37,13 39.22,13 39.67,13.45 J3.7
  Bottom 1.016: Q17.4 Q17.2
VAL_PK2
  Bottom 0.406: D3.A 56.23,14.4 J4.7
  Bottom 0.61: Q18.2 53,12.5 53.5,13 55.7,13 56.18,13.48 56.18,14.34 J4.7
  Bottom 1.016: Q18.2 Q18.4
VCCIO  (via drill 0.35 pad 0.65)
  Top 0.203: C15.1 28.63,38.49 28.62,38.5
  Top 0.254: Q13.1 41.97,26.03 42.38,25.62 42.38,23.67 42.75,23.3 43.75,23.3 | v60.98,23.42 60.95,23.42 R34.1 | Q14.1 59.42,25.95 60,25.38 60,23.79 60.38,23.42 v60.98,23.42 | v60.98,23.42 | C48.1 46.01,23.29 v46,23.31 | 46,41.75 v46,41.5 | D4.A 60.27,23.32 60.37,23.42 v60.98,23.42 | v60.98,23.42
  Top 0.305: 28.81,49.84 C16.1 | C21.1 36.4,41 IC7.14 | C22.1 IC7.24 | IC7.34 C23.1 v43.99,31.64 43.99,39.49 45.38,40.88 | v48.99,31.64 C24.1 IC7.44 49,38.5 46.71,40.79 v46,41.5 | C26.1 IC7.54 | C28.1 | C28.1 IC7.64 | C30.1 IC7.74 51.5,47 v46,41.5 | C31.1 IC7.83 | C31.1 48.5,46 46,43.5 46,41.75 | OSC1.P$4 C20.1 49.27,55.02 49.75,55.5 | IC12.5 12.5,23.3 C44.1 | C48.1 47.54,23.29 IC16.5 | C46.1 29.5,23.05 29.75,23.3 IC14.5 | R35.1 23.25,23.55 v23.5,23.3 | R33.1 43.25,23.55 43.5,23.3 43.75,23.3 v44.11,23.3 v44.11,23.29 | 45.38,40.88 | 45.38,40.88 v46,41.5 | 49.75,55.5 49.75,56.38 50.03,56.66 PDI.2 | C31.1 49.6,51.35 49.75,51.5 49.75,55.5 | v32.38,54.62 32.38,50.06 32.17,49.85 C32.1
  Top 0.356: IC4.4 28.62,38.31
  Top 0.406: C15.1 28.63,34.97 28.75,34.84 v29.16,34.84 | CLKIN.1 6.76,34.17 9.83,34.17 v10.51,34.84 | 12.5,23.3 v11.31,23.3 | C48.1 | C46.1 v29.5,23.3 | v18.25,23.3 18.75,23.8 18.75,34.59 v18.5,34.84 | 28.62,38.31 28.62,38.5 28.62,41.8 28.84,42.03 | 28.84,42.03 29.81,43 29.81,49.79 29.75,49.85 | C32.1 29.75,49.85 | 29.75,49.85 29.14,49.85 C16.1 | v28.88,42 | v28.88,42 28.84,42.03
  Top 0.61: IC3.5 28.81,49.84
  Bottom 0.254: v46,23.31
  Bottom 0.305: C22.1 40,36 40.5,36 45.5,41 | C26.1 52,37 50.5,37 v46,41.5 | C28.1 46.5,42 v46,41.5 | Q15.1 24.64,23.4 24.75,23.3 | C21.1 36.25,41.25 36.5,41 45.5,41 | 45.62,41.12 v46,41.5 | v46,41.5 | 45.5,41 | 45.5,41 v46,41.5 | R17.1 R10.1 38.77,54.9 38.75,54.88 32.62,54.88 v32.38,54.62
  Bottom 0.406: v10.51,34.84 v18.5,34.84 v29.16,34.84 | v11.31,23.3 v18.25,23.3 v23.5,23.3 24.75,23.3 v29.5,23.3 v60.98,23.42 v46,23.31 v44.11,23.29 | v28.88,42 45.5,42 v46,41.5
  other vias: 36.15,41.25 36.14,36 55.86,37 55.85,42
VDD  (via drill 0.35 pad 0.65)
  Top 0.254: D4.C 62.48,21.27 62.5,21.25
  Top 0.305: C25.1 v36.14,45.99 v36.15,46 IC7.4 v40.75,46 | C27.1 IC7.94 43,46.5 42.5,46 v40.75,46 | C29.1 38.75,48.5 40.75,46.5 v40.75,46
  Top 0.406: v62.5,9.75 62.5,21.25 62.5,45.75 v62.25,46 | v61.5,6.25 61.5,4.5 62,4 64.5,4 65,3.5 77.7,3.5 v77.9,3.7
  Bottom 0.203: C36.1 61.65,7.4
  Bottom 0.254: C39.1 79.66,4.5 IC10.5
  Bottom 0.305: IC9.5 62.35,9.6 v62.5,9.75
  Bottom 0.406: v40.75,46 v62.25,46 | IC9.5 61.55,7.6 C36.1 61.5,7.47 v61.5,6.25 | v77.9,3.7 C39.1
  other vias: 43,51.35

### Text on the board
tPlace: Licensed under the TAPR Open / Hardware License (www.tapr.org/OHL) / / Copyright 2017 Artur Silva and Filipe Carvalho | Licensed under the TAPR Open Hardware / License (www.tapr.org/OHL) | A | LED1 | K | A | LED0 | K | 12V / Only! | harp behavior v1.2 | Hardware Platform | RGB LED | www.cf-hw.org | 5V | S | G | 5V Outputs | DO3 | DO2 | GND | 5V Outputs | DO1 | DO0 | GND | PORT0 | PORT2 | GND | ADC | GND | +5V